# EAGLE board Timing_Control_V1p1 (EAGLE 9.6.2), part 1 of 2
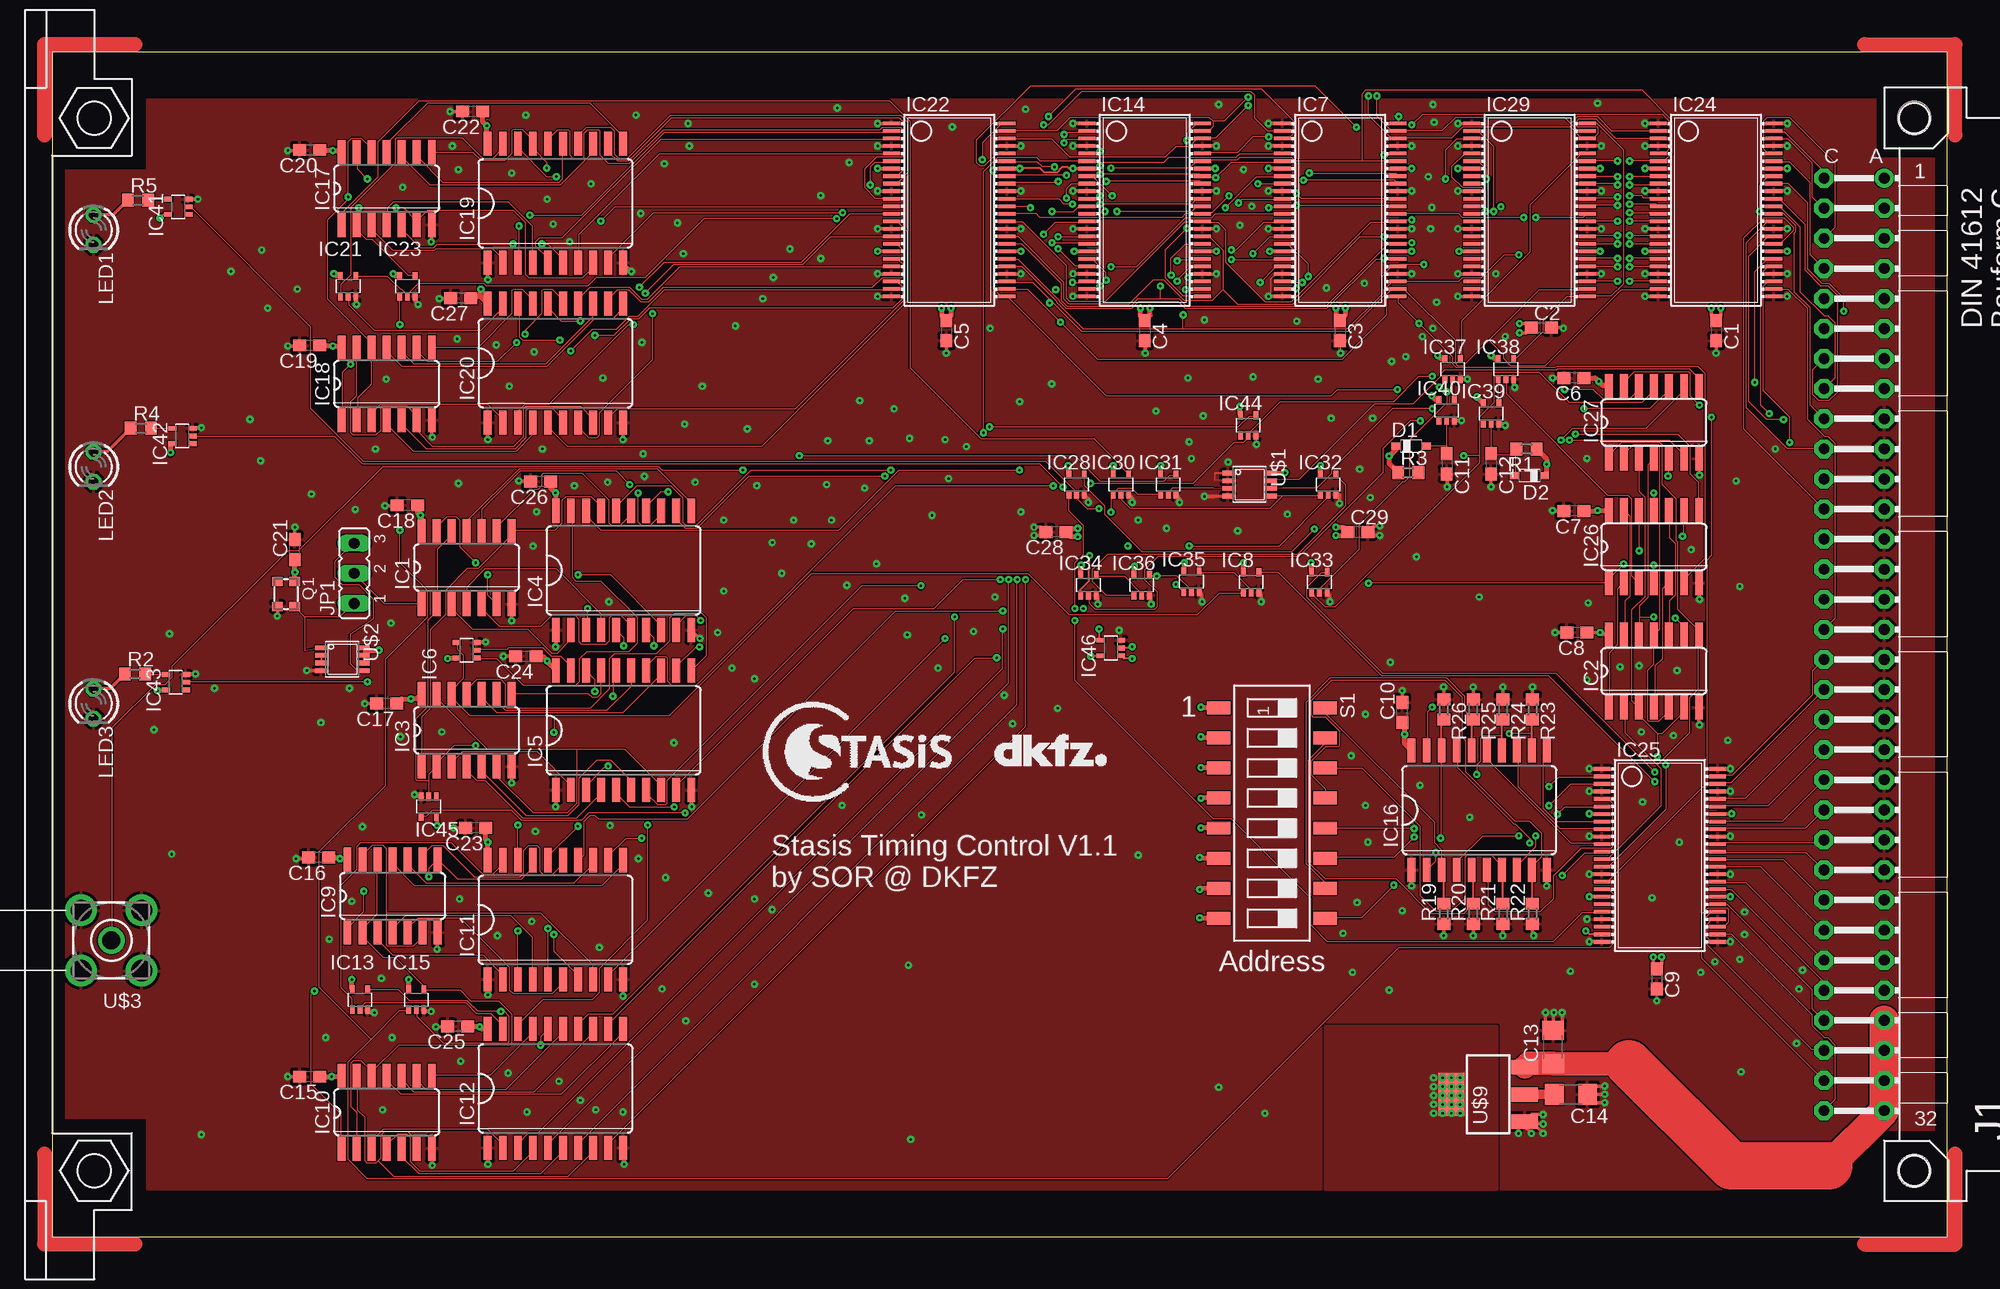
[diagram p5: board, top side]
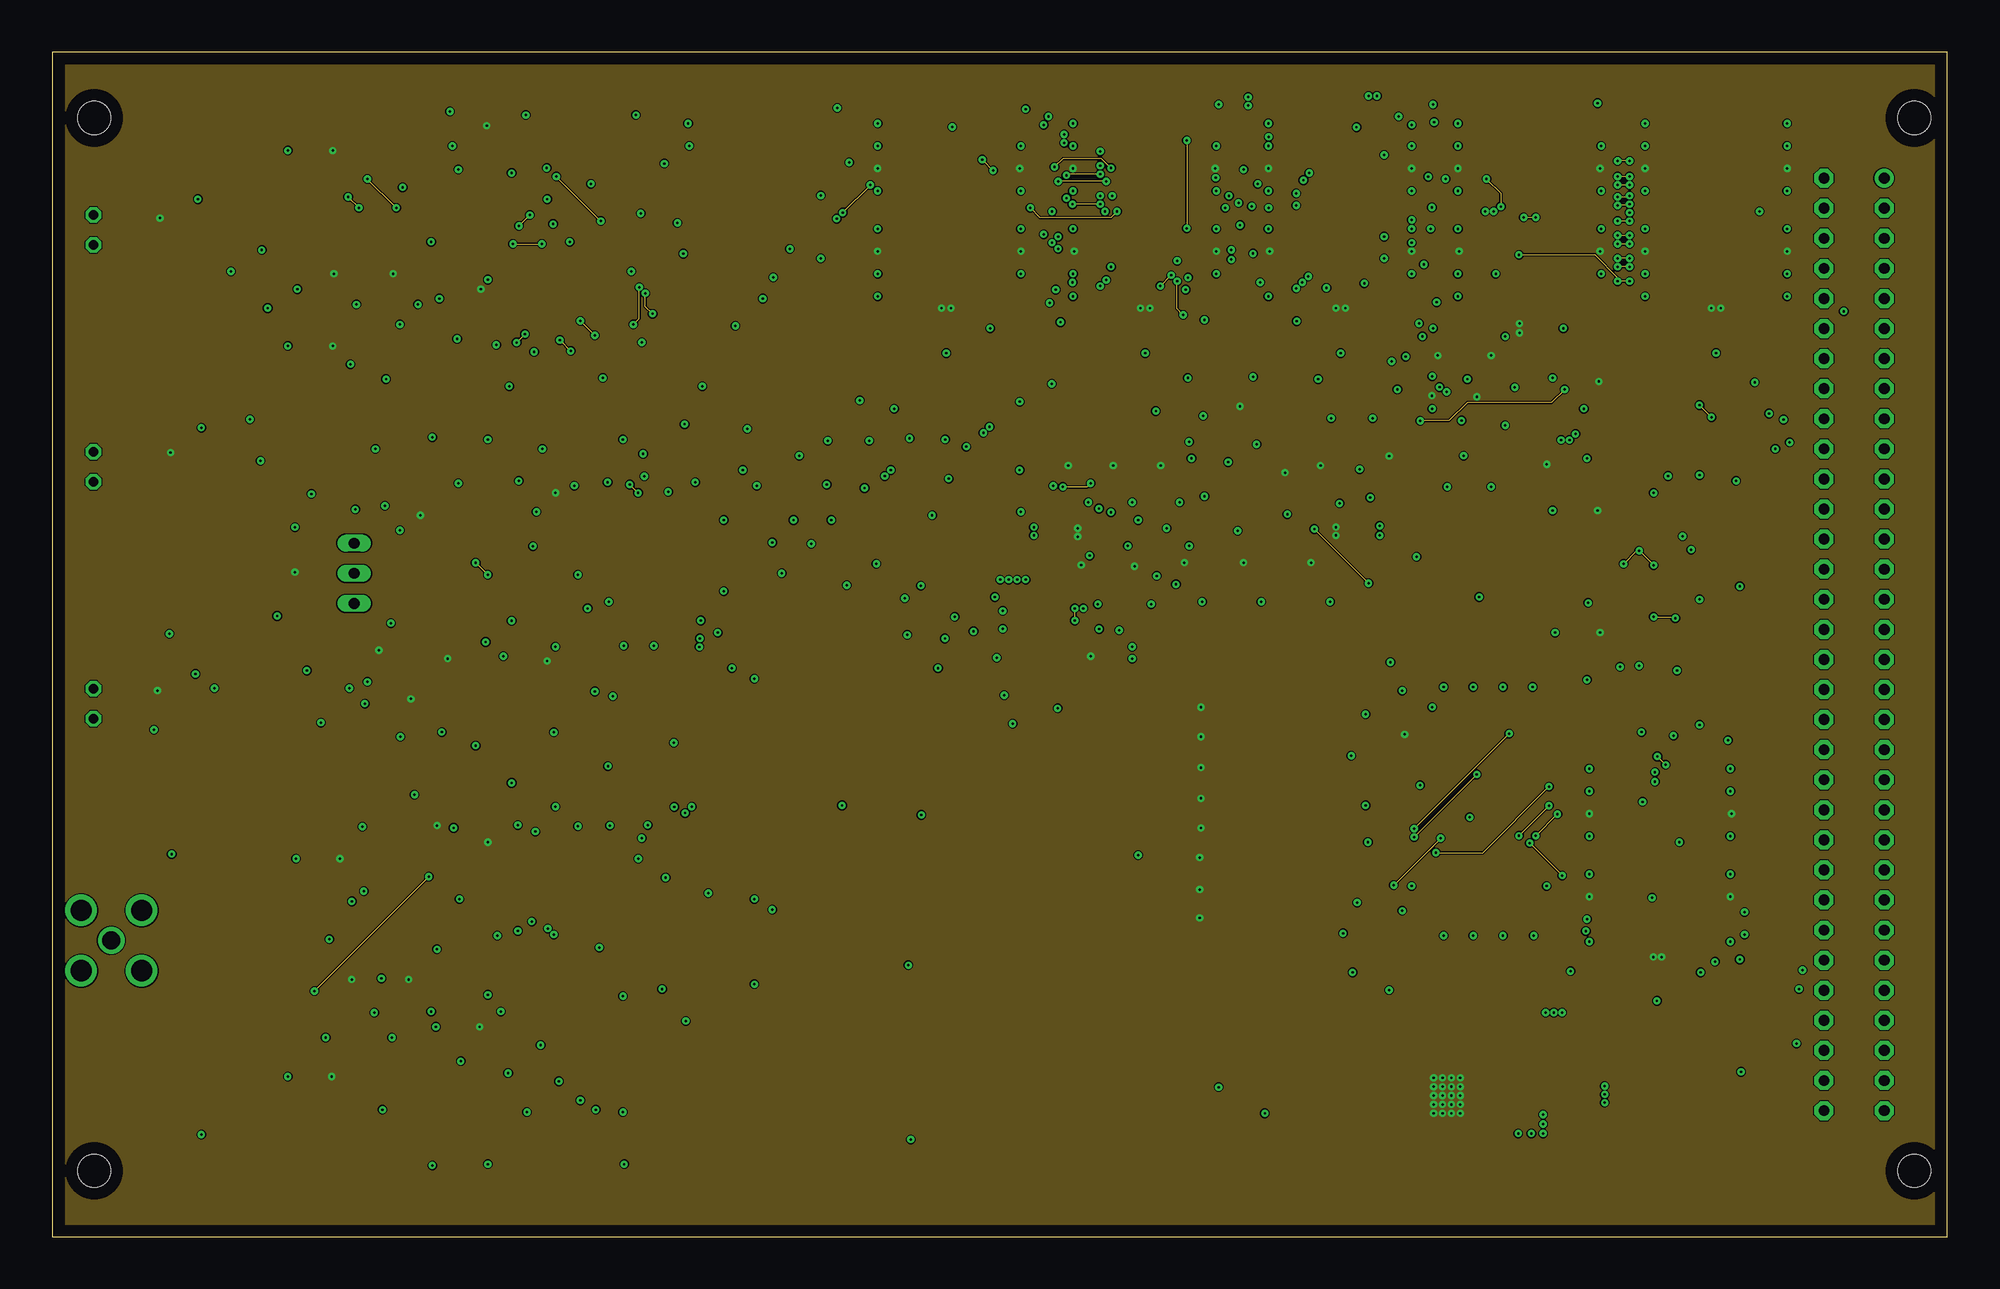
[diagram p6: board, inner layer VCC]
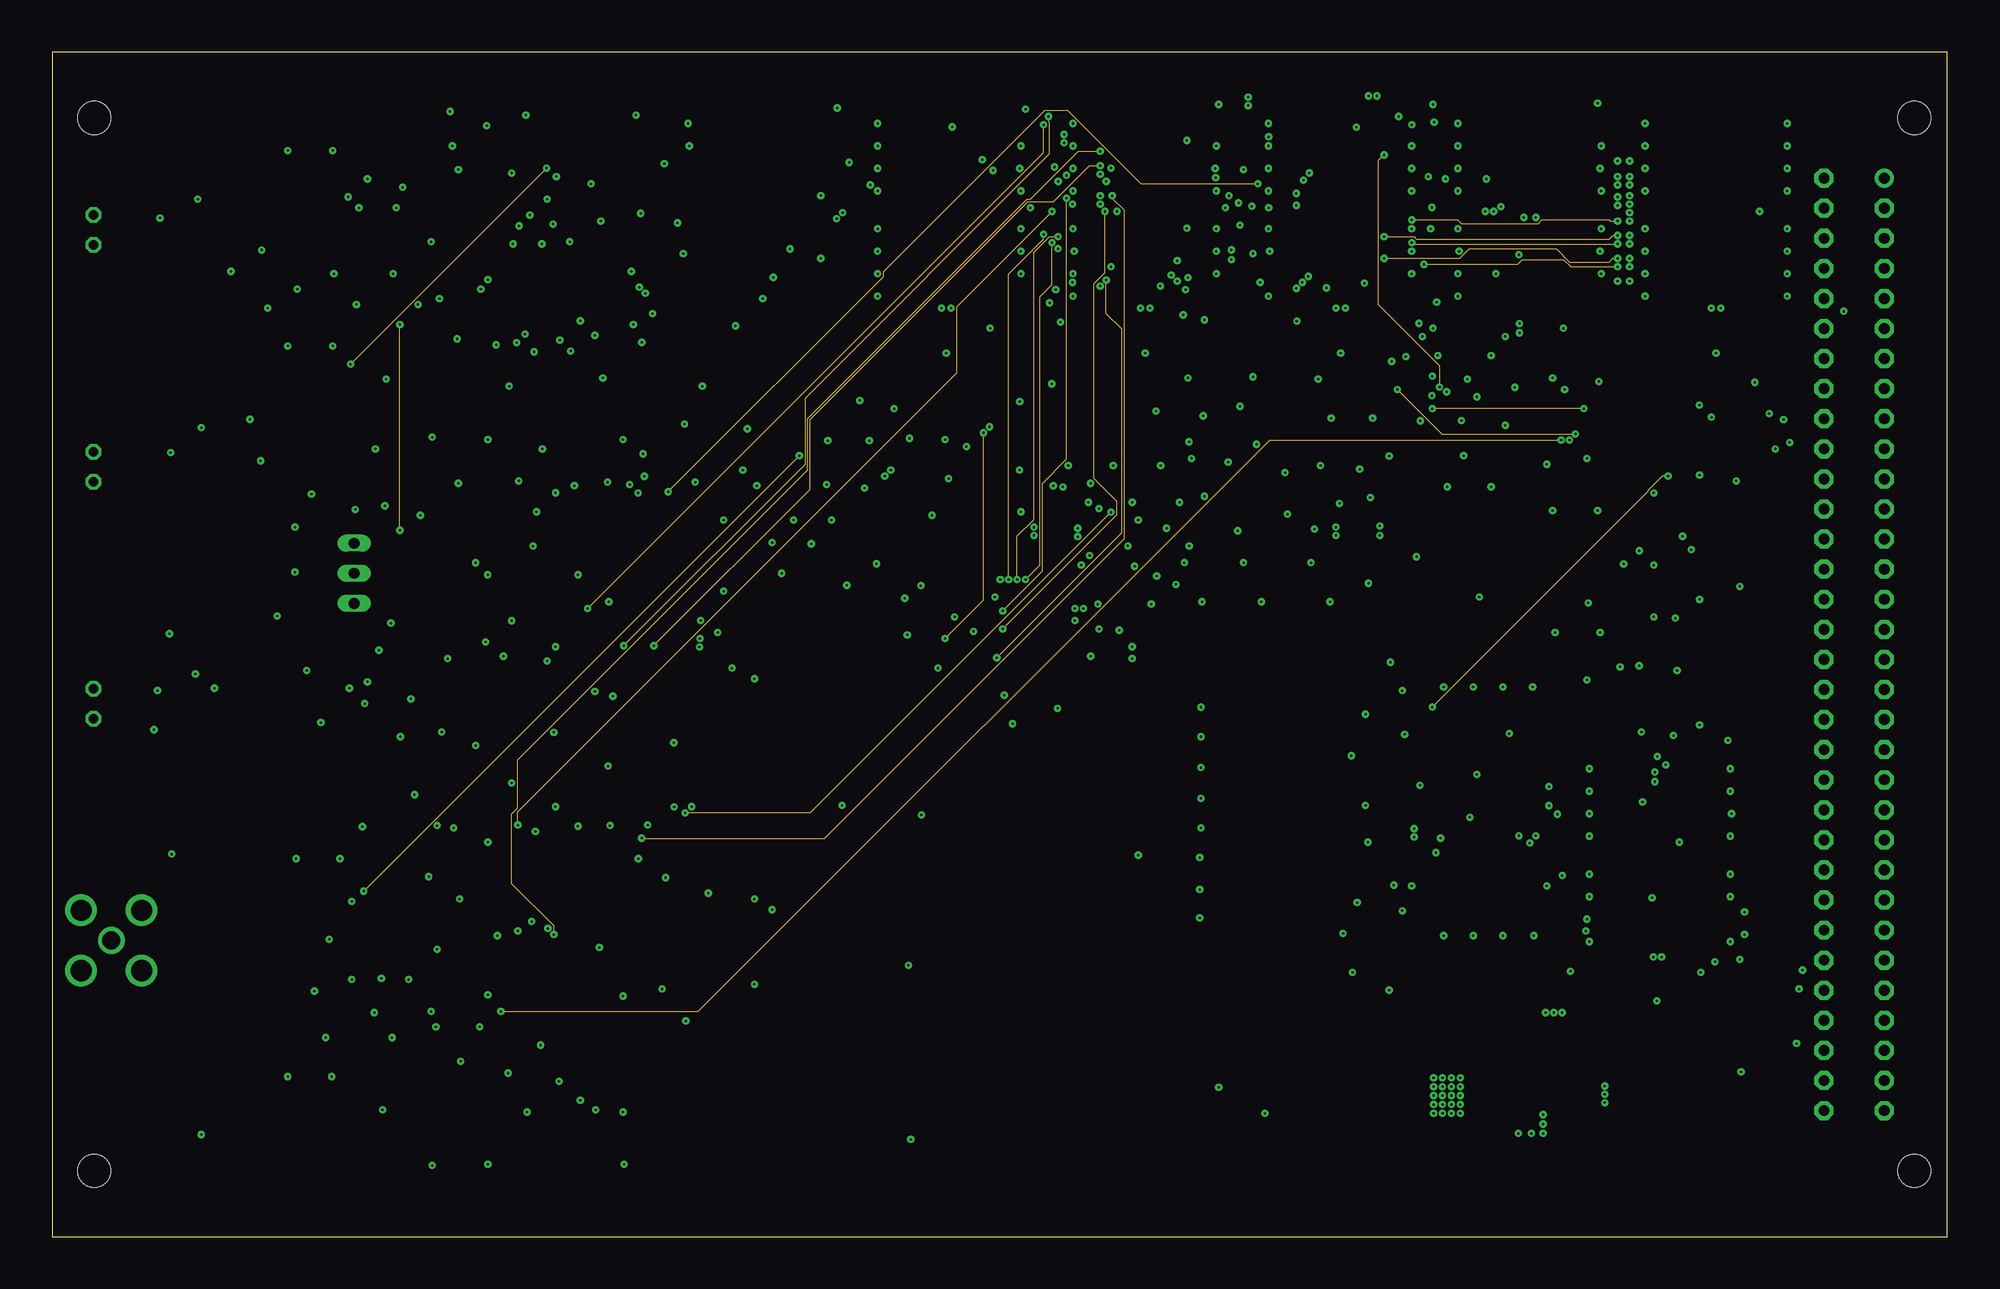
[diagram p7: board, inner layer Route3]
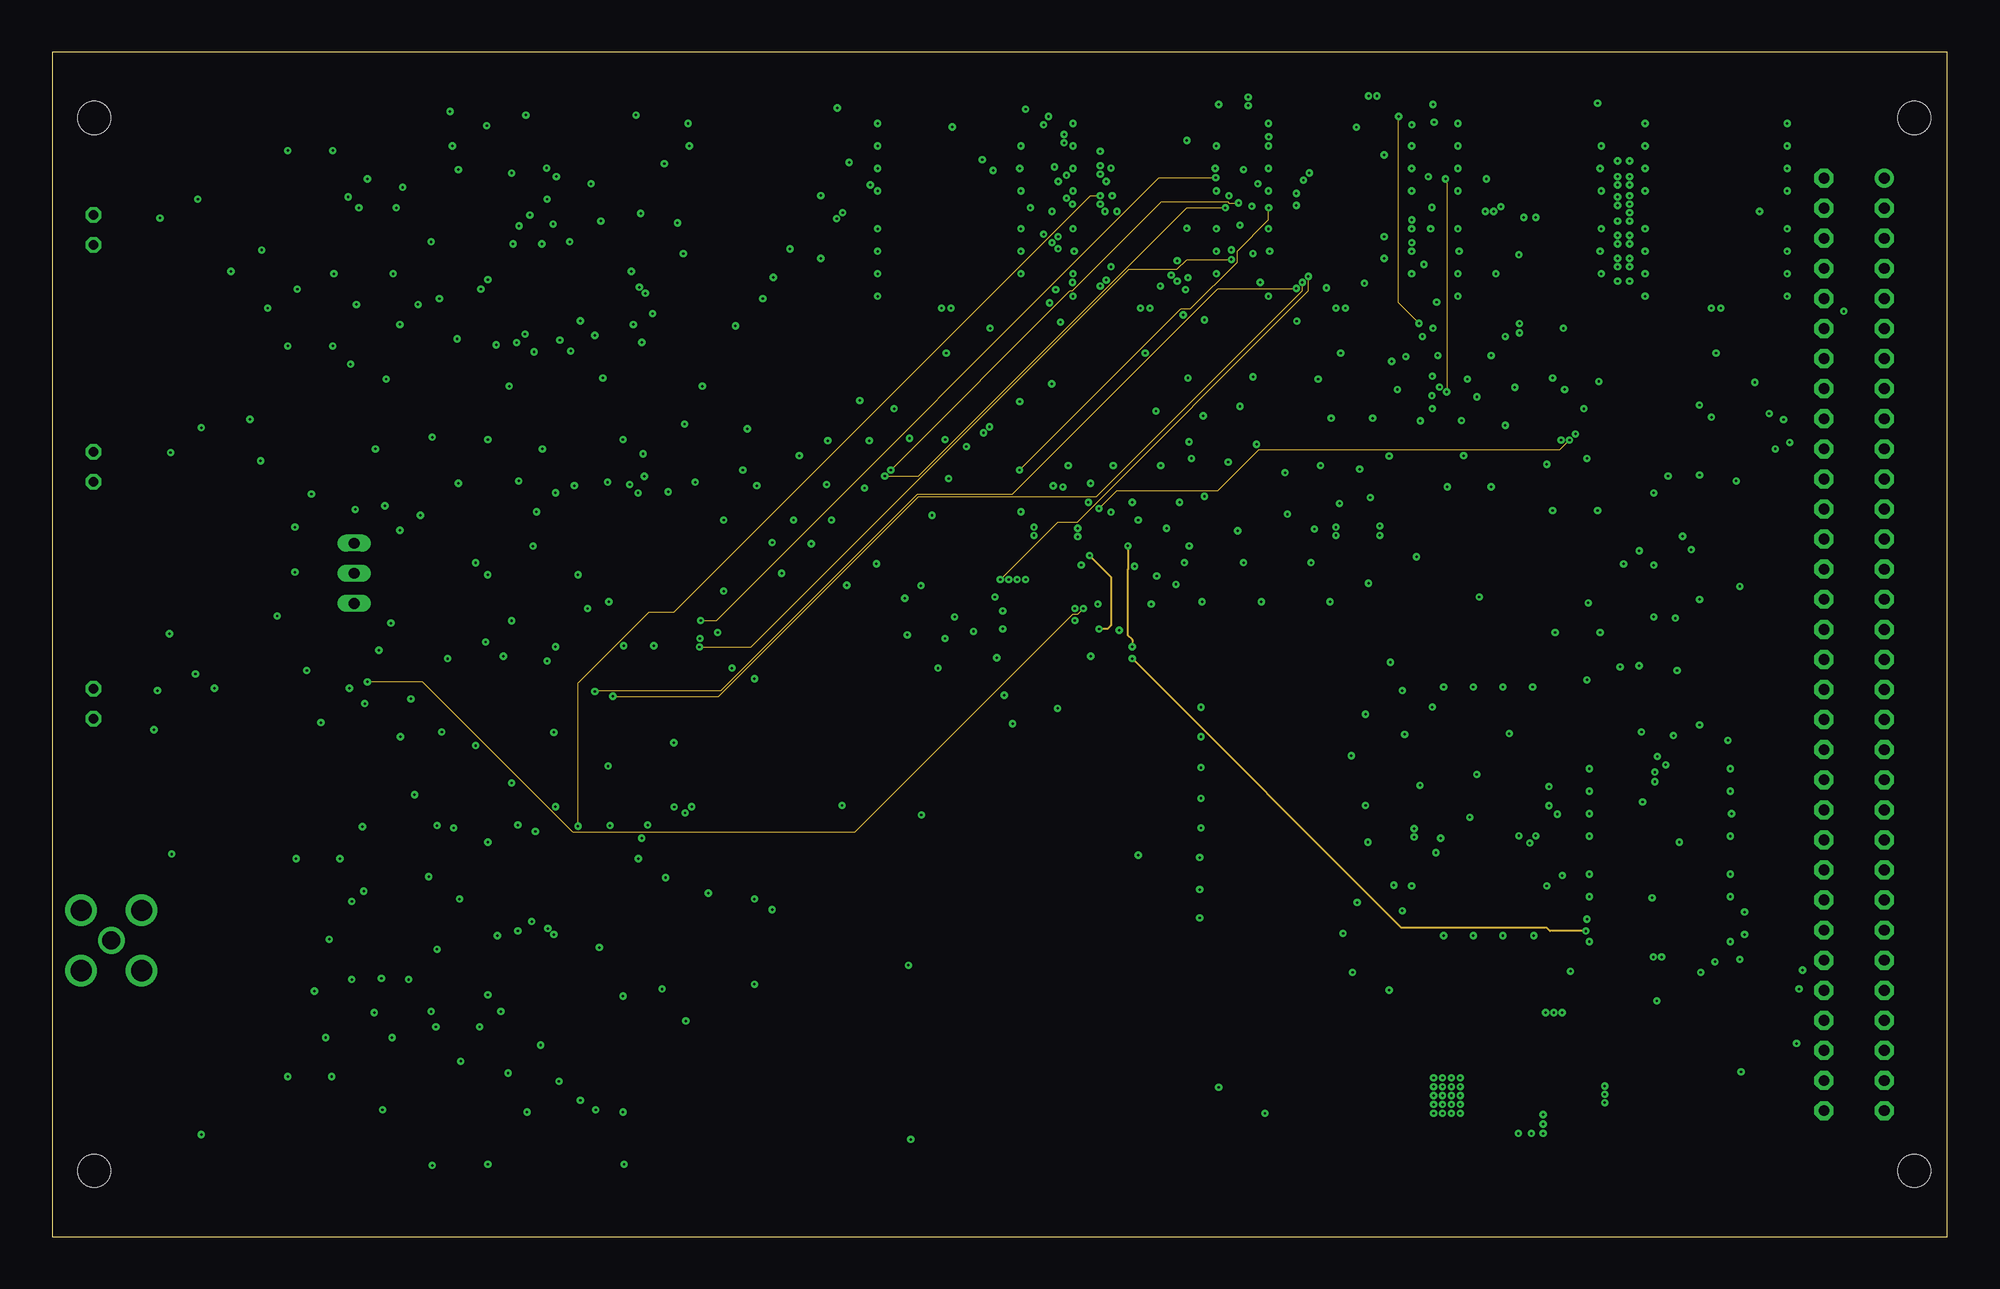
[diagram p8: board, inner layer Route14]
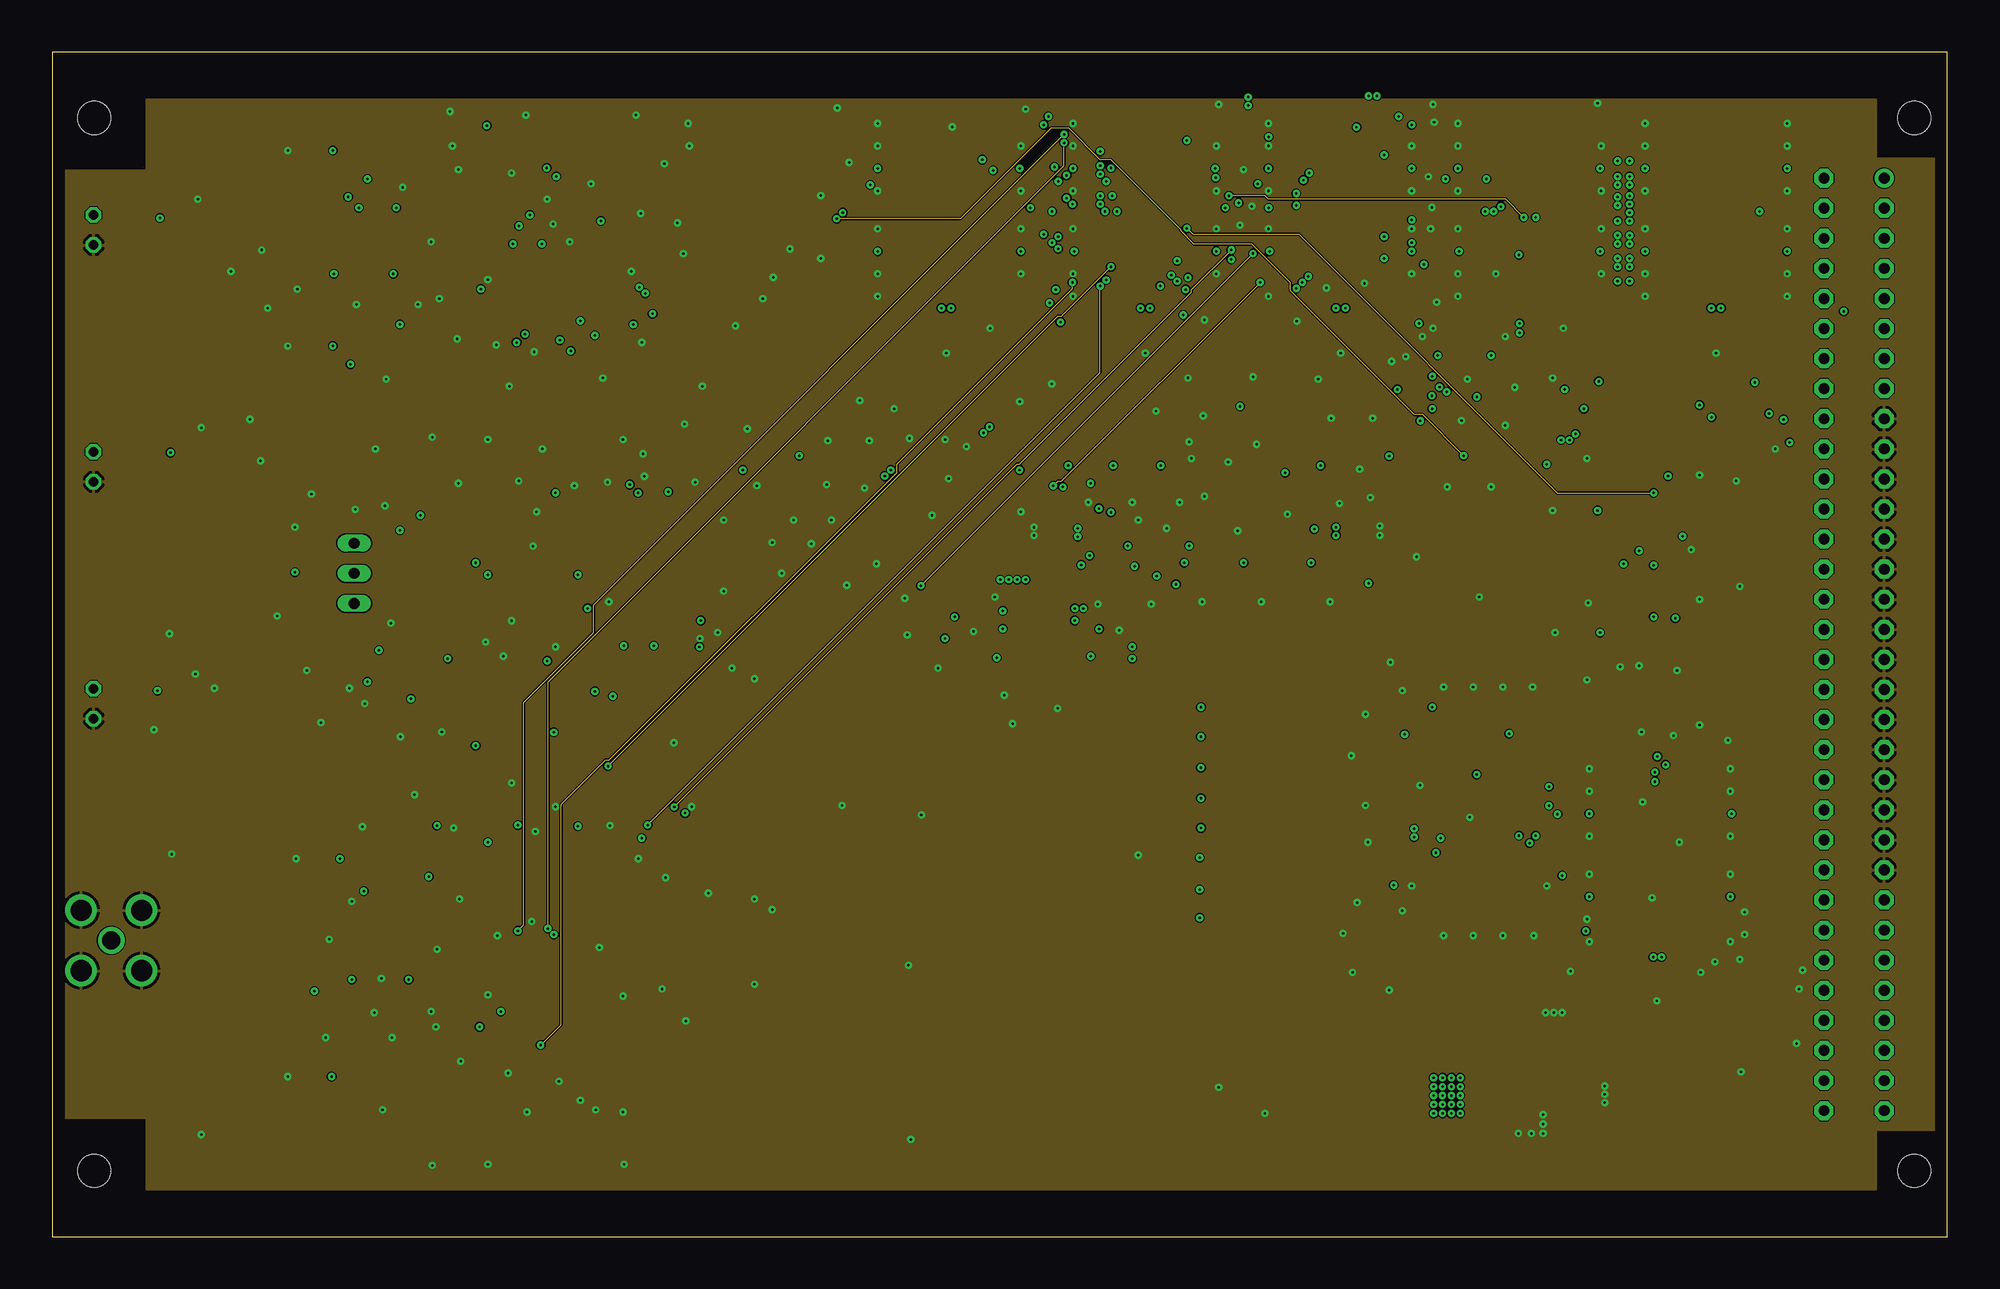
[diagram p9: board, inner layer Route15]
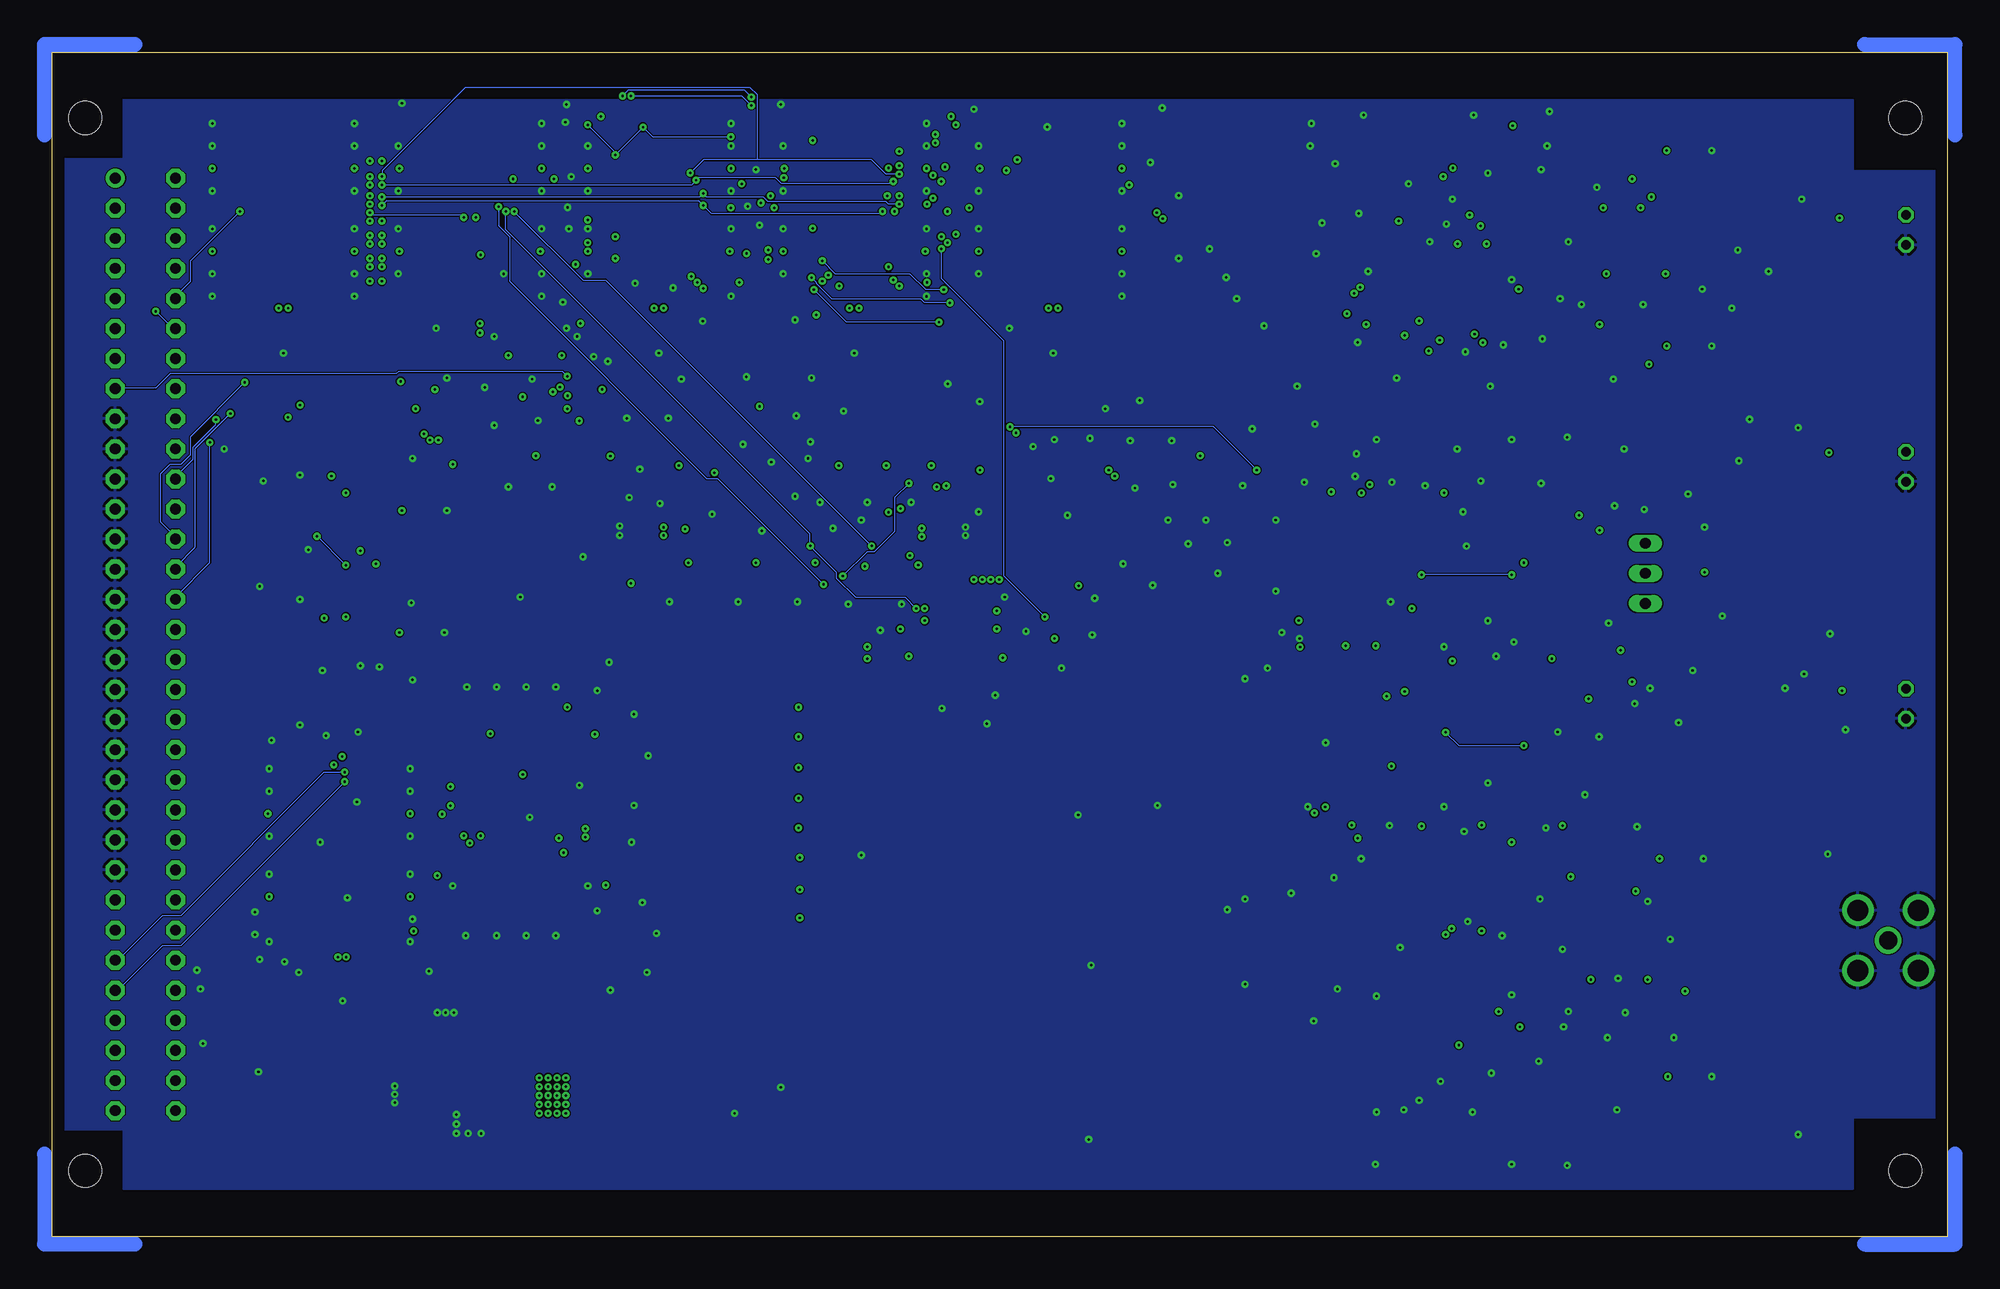
[diagram p10: board, bottom side, seen from below]

Size 160.02 x 100.03 mm. Coordinates in mm from the lower left corner, seen from the top.
Copper layers (1+2*3+14*15+16): Top 0.035mm / dielectric 0.23mm / VCC 0.035mm / dielectric 0.3mm / Route3 0.035mm / dielectric 0.34mm / Route14 0.035mm / dielectric 0.3mm / Route15 0.035mm / dielectric 0.23mm / Bottom 0.035mm
Design rules "default *": minimum track width 4mil, minimum drill 0.2mm, track to track 4mil, track to pad 4mil, pad to pad 4mil, via to via 4mil, smd to smd 4mil, copper to edge 40mil, drill to drill 6mil, minimum pad ring 10mil, minimum via ring 8mil, stop-mask expansion 4mil, vias tented up to drill 20mil, thermal gap 10mil

## Footprints (pad centres in the part's own frame; a part is rotated, then mirrored left to right if it is on the bottom)
C0603 = smd 1.1 x 1: 1 -0.85,0; 2 0.85,0
C1206 = smd 1.6 x 1.8: 1 -1.4,0; 2 1.4,0
SOD323_ST = smd 0.8 x 0.6: A 1.25,0; C -1.25,0
SO14 = smd 0.66 x 2.032: 1 -3.81,-3.073; 2 -2.54,-3.073; 3 -1.27,-3.073; 4 0,-3.073; 5 1.27,-3.073; 6 2.54,-3.073; 7 3.81,-3.073; 8 3.81,3.073; 9 2.54,3.073; 10 1.27,3.073; 11 0,3.073; 12 -1.27,3.073; 13 -2.54,3.073; 14 -3.81,3.073
SO20W = smd 0.66 x 2.032: 1 -5.715,-5.029; 2 -4.445,-5.029; 3 -3.175,-5.029; 4 -1.905,-5.029; 5 -0.635,-5.029; 6 0.635,-5.029; 7 1.905,-5.029; 8 3.175,-5.029; 9 4.445,-5.029; 10 5.715,-5.029; 11 5.715,5.029; 12 4.445,5.029; 13 3.175,5.029; 14 1.905,5.029; 15 0.635,5.029; 16 -0.635,5.029; 17 -1.905,5.029; 18 -3.175,5.029; 19 -4.445,5.029; 20 -5.715,5.029
SC70-5 = smd 0.4 x 0.7: 1 -0.65,-0.85; 2 0,-0.85; 3 0.65,-0.85; 4 0.65,0.85; 5 -0.65,0.85
SSOP48DL = smd 0.305 x 1.422: 1 -6.985,-4.877; 2 -6.35,-4.877; 3 -5.715,-4.877; 4 -5.08,-4.877; 5 -4.445,-4.877; 6 -3.81,-4.877; 7 -3.175,-4.877; 8 -2.54,-4.877; 9 -1.905,-4.877; 10 -1.27,-4.877; 11 -0.635,-4.877; 12 0,-4.877; 13 0.635,-4.877; 14 1.27,-4.877; 15 1.905,-4.877; 16 2.54,-4.877; 17 3.175,-4.877; 18 3.81,-4.877; 19 4.445,-4.877; 20 5.08,-4.877; 21 5.715,-4.877; 22 6.35,-4.877; 23 6.985,-4.877; 24 7.62,-4.877; 25 7.62,4.877; 26 6.985,4.877; 27 6.35,4.877; 28 5.715,4.877; 29 5.08,4.877; 30 4.445,4.877; 31 3.81,4.877; 32 3.175,4.877; 33 2.54,4.877; 34 1.905,4.877; 35 1.27,4.877; 36 0.635,4.877; 37 0,4.877; 38 -0.635,4.877; 39 -1.27,4.877; 40 -1.905,4.877; 41 -2.54,4.877; 42 -3.175,4.877; 43 -3.81,4.877; 44 -4.445,4.877; 45 -5.08,4.877; 46 -5.715,4.877; 47 -6.35,4.877; 48 -6.985,4.877
VG64P = drill 0.914 pad 1.6: A1 154.94,39.37 | drill 0.914 pad 1.6 octagon: A2 154.94,36.83; A3 154.94,34.29; A4 154.94,31.75; A5 154.94,29.21; A6 154.94,26.67; A7 154.94,24.13; A8 154.94,21.59; A9 154.94,19.05; A10 154.94,16.51; A11 154.94,13.97; A12 154.94,11.43; A13 154.94,8.89; A14 154.94,6.35; A15 154.94,3.81; A16 154.94,1.27; A17 154.94,-1.27; A18 154.94,-3.81; A19 154.94,-6.35; A20 154.94,-8.89; A21 154.94,-11.43; A22 154.94,-13.97; A23 154.94,-16.51; A24 154.94,-19.05; A25 154.94,-21.59; A26 154.94,-24.13; A27 154.94,-26.67; A28 154.94,-29.21; A29 154.94,-31.75; A30 154.94,-34.29; A31 154.94,-36.83; A32 154.94,-39.37; C1 149.86,39.37; C2 149.86,36.83; C3 149.86,34.29; C4 149.86,31.75; C5 149.86,29.21; C6 149.86,26.67; C7 149.86,24.13; C8 149.86,21.59; C9 149.86,19.05; C10 149.86,16.51; C11 149.86,13.97; C12 149.86,11.43; C13 149.86,8.89; C14 149.86,6.35; C15 149.86,3.81; C16 149.86,1.27; C17 149.86,-1.27; C18 149.86,-3.81; C19 149.86,-6.35; C20 149.86,-8.89; C21 149.86,-11.43; C22 149.86,-13.97; C23 149.86,-16.51; C24 149.86,-19.05; C25 149.86,-21.59; C26 149.86,-24.13; C27 149.86,-26.67; C28 149.86,-29.21; C29 149.86,-31.75; C30 149.86,-34.29; C31 149.86,-36.83; C32 149.86,-39.37 | hole 2.794: 3.81,44.45; 3.81,-44.45; 157.48,44.45; 157.48,-44.45
JP2 = drill 0.914 long: 1 -2.54,0; 2 0,0; 3 2.54,0
LED3MM = drill 0.813 octagon: A -1.27,0; K 1.27,0
2.5X2.0_KXO-86-TCXO = smd 0.75 x 0.9: 1 -1.05,-0.725; 2 1.05,-0.725; 3 1.05,0.725; 4 -1.05,0.725
R0603 = smd 1 x 1.1: 1 -0.85,0; 2 0.85,0
SMS-008 = smd 1.092 x 2.007: 1 -8.89,-4.496; 2 -6.35,-4.496; 3 -3.81,-4.496; 4 -1.27,-4.496; 5 1.27,-4.496; 6 3.81,-4.496; 7 6.35,-4.496; 8 8.89,-4.496; 9 8.89,4.496; 10 6.35,4.496; 11 3.81,4.496; 12 1.27,4.496; 13 -1.27,4.496; 14 -3.81,4.496; 15 -6.35,4.496; 16 -8.89,4.496
SSOP08 = smd 0.4 x 1: 1 -0.975,-1.8; 2 -0.325,-1.8; 3 0.325,-1.8; 4 0.975,-1.8; 5 0.975,1.8; 6 0.325,1.8; 7 -0.325,1.8; 8 -0.975,1.8
BU-SMA-H = drill 1.5: 1 0,0 | drill 1.778: 2 -2.55,2.55; 3 2.55,2.55; 4 2.55,-2.55; 5 -2.55,-2.55
SOT223 = smd 1.219 x 2.235: 1 -2.311,-3.099; 2 0,-3.099; 3 2.311,-3.099 | smd 3.6 x 2.2: 4 0,3.099

## Placement (x,y rotation side)
C1  10nF  [C0603]  140.5,76.51 270 top
C2  10nF  [C0603]  125.75,76.76 0 top
C3  10nF  [C0603]  108.75,76.51 270 top
C4  10nF  [C0603]  92.25,76.51 270 top
C5  10nF  [C0603]  75.5,76.51 270 top
C6  10nF  [C0603]  128.5,72.51 180 top
C7  10nF  [C0603]  128.5,61.26 180 top
C8  10nF  [C0603]  128.75,51.01 180 top
C9  10nF  [C0603]  135.5,21.76 270 top
C10  10nF  [C0603]  114,44.26 90 top
C11  10nF  [C0603]  117.75,65.26 270 top
C12  10nF  [C0603]  121.5,65.26 270 top
C13  10µF  [C1206]  126.75,16.01 90 top
C14  22µF  [C1206]  128.25,12.01 0 top
C15  10nF  [C0603]  21.75,13.51 180 top
C16  10nF  [C0603]  22.5,32.01 180 top
C17  10nF  [C0603]  28.25,45.01 180 top
C18  10nF  [C0603]  30,61.76 180 top
C19  10nF  [C0603]  21.75,75.26 180 top
C20  10nF  [C0603]  21.75,91.76 180 top
C21  10nF  [C0603]  20.5,58.01 90 top
C22  10nF  [C0603]  35.5,95.01 180 top
C23  10nF  [C0603]  35.75,34.51 180 top
C24  10nF  [C0603]  40,49.01 180 top
C25  10nF  [C0603]  34.25,17.76 180 top
C26  10nF  [C0603]  41.25,63.76 180 top
C27  10nF  [C0603]  34.5,79.26 180 top
C28  10nF  [C0603]  84.75,59.51 180 top
C29  10nF  [C0603]  110.25,59.51 0 top
D1  BAT60J  [SOD323_ST]  114.75,66.76 0 top
D2  BAT60J  [SOD323_ST]  124.75,64.26 180 top
IC1  SN74LV393ANSR  [SO14]  35,56.51 0 top
IC2  SN74LVC02AD  [SO14]  135.25,47.76 0 top
IC3  SN74LV393ANSR  [SO14]  35,42.76 0 top
IC4  74HC688DW  [SO20W]  48.25,56.26 0 top
IC5  74HC688DW  [SO20W]  48.25,42.76 0 top
IC6  74LVC1G02DCK  [SC70-5]  35,49.51 90 top
IC7  74AC16373  [SSOP48DL]  108.75,87.01 270 top
IC8  74LVC1G08DCK  [SC70-5]  101.25,55.26 0 top
IC9  SN74LV393ANSR  [SO14]  28.75,28.76 0 top
IC10  SN74LV393ANSR  [SO14]  28.25,10.51 0 top
IC11  74HC688DW  [SO20W]  42.5,26.76 0 top
IC12  74HC688DW  [SO20W]  42.5,12.51 0 top
IC13  74LVC1G02DCK  [SC70-5]  26,20.01 0 top
IC14  74AC16373  [SSOP48DL]  92.25,87.01 270 top
IC15  SN74LVC1G32DCKR  [SC70-5]  30.75,20.01 0 top
IC16  74HC688DW  [SO20W]  120.5,36.01 0 top
IC17  SN74LV393ANSR  [SO14]  28.25,88.51 0 top
IC18  SN74LV393ANSR  [SO14]  28.25,72.01 0 top
IC19  74HC688DW  [SO20W]  42.5,87.26 0 top
IC20  74HC688DW  [SO20W]  42.5,73.76 0 top
IC21  74LVC1G02DCK  [SC70-5]  25,80.26 0 top
IC22  74AC16373  [SSOP48DL]  75.75,87.01 270 top
IC23  SN74LVC1G32DCKR  [SC70-5]  30,80.26 0 top
IC24  SN74LVCH16244ADLR  [SSOP48DL]  140.5,87.01 270 top
IC25  SN74LVCH16244ADLR  [SSOP48DL]  135.75,32.51 270 top
IC26  74ALVC08  [SO14]  135.25,58.26 0 top
IC27  74AHC04D-Q100J  [SO14]  135.25,68.76 0 top
IC28  74LVC1G08DCK  [SC70-5]  86.5,63.51 0 top
IC29  74AC16373  [SSOP48DL]  124.75,87.01 270 top
IC30  74LVC1G08DCK  [SC70-5]  90.25,63.51 0 top
IC31  74LVC1G08DCK  [SC70-5]  94.25,63.51 0 top
IC32  SN74LVC1G32DCKR  [SC70-5]  107.75,63.51 0 top
IC33  74LVC1G08DCK  [SC70-5]  107,55.26 0 top
IC34  74LVC1G08DCK  [SC70-5]  87.5,55.01 0 top
IC35  74LVC1G08DCK  [SC70-5]  96.2,55.31 0 top
IC36  74LVC1G08DCK  [SC70-5]  92,55.01 0 top
IC37  74LVC1G08DCK  [SC70-5]  118.25,73.26 0 top
IC38  SN74LVC1G32DCKR  [SC70-5]  122.75,73.26 0 top
IC39  74LVC1G14DCK  [SC70-5]  121.5,69.51 0 top
IC40  74LVC1G17DCK  [SC70-5]  117.75,69.76 0 top
IC41  74LVC1G17DCK  [SC70-5]  10.65,86.96 90 top
IC42  74LVC1G17DCK  [SC70-5]  11,67.61 90 top
IC43  74LVC1G17DCK  [SC70-5]  10.45,46.81 90 top
IC44  74LVC1G17DCK  [SC70-5]  101,68.51 0 top
IC45  74LVC1G14DCK  [SC70-5]  31.8,36.31 180 top
IC46  74LVC1G08DCK  [SC70-5]  89.4,49.71 90 top
J1  BUS  [VG64P]  -0.25,50.01 0 top
JP1  1/2 Clock  [JP2]  25.5,56.01 90 top
LED1  10mA 2.2-2.4V  [LED3MM]  3.5,85.01 270 top
LED2  10mA 2.2-2.4V  [LED3MM]  3.5,65.01 270 top
LED3  10mA 2.2-2.4V  [LED3MM]  3.5,45.01 270 top
Q1  ECS-TXO-2520MV-100-AN-TR  [2.5X2.0_KXO-86-TCXO]  19.75,54.26 270 top
R1  1k  [R0603]  124.5,66.51 180 top
R2  120  [R0603]  7,47.51 0 top
R3  1k  [R0603]  114.5,64.51 0 top
R4  120  [R0603]  7.5,68.26 0 top
R5  120  [R0603]  7.25,87.51 0 top
R19  100k  [R0603]  117.5,27.26 90 top
R20  100k  [R0603]  120,27.26 90 top
R21  100k  [R0603]  122.5,27.26 90 top
R22  100k  [R0603]  125,27.26 90 top
R23  100k  [R0603]  125,44.51 270 top
R24  100k  [R0603]  122.5,44.51 270 top
R25  100k  [R0603]  120,44.51 270 top
R26  100k  [R0603]  117.5,44.51 270 top
S1  SWS008  [SMS-008]  103,35.76 270 top
U$1  74LVC2G74DP,125  [SSOP08]  101.1,63.51 270 top
U$2  74LVC2G74DP,125  [SSOP08]  24.5,48.76 270 top
U$3  SMA_CON-H  [BU-SMA-H]  5,25.01 180 top
U$4  [LOGO_STASIS]  69,40.71 0 top
U$5  [LOGO_DKFZ]  79.6,39.71 0 top
U$9  AZ1117IH-3.3TRG1  [SOT223]  121.25,12.01 90 top

## Tracks (layer width: path | path; a pad name or v marks a point on that pad's centre or on a via)
5V
  Top 2: 133.15,14.61 C13.1 126.73,14.62 124.64,14.62 U$9.3
  Top 2.54: J1.A29 J1.A30 J1.A31 J1.A32 150.01,5.96
  Top 4: 150.01,5.96 141.8,5.96 133.15,14.61
ADDR0  (via drill 0.2)
  Top 0.102: v126.39,38.01 127.2,38.82 130.86,38.82 IC25.2 | v116.84,32.42 116.84,31.71 116.12,31 IC16.2
  VCC 0.102: v126.39,38.01 120.8,32.42 v116.84,32.42
ADDR1  (via drill 0.2)
  Top 0.102: v126.39,36.39 128.22,38.21 130.86,38.21 IC25.3 | v123.85,33.85 120.8,33.85 118.66,31.71 118.66,31 IC16.4
  VCC 0.102: v123.85,33.85 v126.39,36.39
ADDR2
  Top 0.102: IC25.5 130.96,36.89 131.47,36.89 131.77,36.59 131.77,32.93 131.67,32.83 129.13,32.83 126.79,30.49 126.79,28.56 125.67,27.44 121.81,27.44 121.2,28.05 121.2,30.9 IC16.6
ADDR3  (via drill 0.2)
  Top 0.102: v127.1,35.67 127.71,36.28 130.86,36.28 IC25.6 | v125.27,33.85 125.27,32.93 123.74,31.41 123.74,31 IC16.8
  VCC 0.102: v125.27,33.85 v127.1,35.67
ADDR4
  Top 0.102: IC25.8 130.86,35.06 127,35.06 125.88,36.18 125.88,40.65 126.18,40.96 IC16.11
ADDR5
  Top 0.102: IC25.9 130.86,34.45 127.3,34.45 123.74,38.01 123.74,40.96 IC16.13
ADDR6
  Top 0.102: IC25.11 130.86,33.24 128.22,33.24 121.2,40.25 121.2,40.96 IC16.15
ADDR7  (via drill 0.2)
  Top 0.102: v127.5,30.49 129.43,32.42 130.86,32.42 IC25.12 | v124.76,33.24 124.76,33.64 123.54,34.86 123.44,34.86 118.66,39.64 118.66,40.96 IC16.17
  VCC 0.102: v124.76,33.24 v127.5,30.49
B1  (via drill 0.2)
  Top 0.102: v83.71,93.89 84.12,93.89 86.97,96.74 101.19,96.74 101.49,96.43 101.49,94.5 102.61,93.38 103.83,93.38 IC7.2 | v45.21,53.05 45.21,51.42 45.11,51.32 IC4.3
  Route3 0.102: v83.71,93.89 83.71,91.55 v45.21,53.05
B2  (via drill 0.2)
  Top 0.102: v84.12,94.6 86.46,96.94 102.1,96.94 104.75,94.3 104.75,93.08 104.44,92.77 103.93,92.77 IC7.3 | v48.26,49.9 48.26,50.61 47.65,51.22 IC4.5
  Route3 0.102: v84.12,94.6 84.12,94.2 84.22,94.09 84.22,91.45 63.6,70.83 63.6,65.24 v48.26,49.9
B3  (via drill 0.2)
  Top 0.102: v88.49,90.44 88.79,90.74 93.87,90.74 94.28,91.15 99.97,91.15 100.27,91.45 103.83,91.45 IC7.5 | v50.8,49.9 50.8,50.61 50.19,51.22 IC4.7
  Route3 0.102: v88.49,90.44 87.57,90.44 84.53,87.39 82.39,87.39 64,69 64,63.11 v50.8,49.9
B4  (via drill 0.2)
  Top 0.102: v98.24,89.42 99.56,90.74 103.83,90.74 IC7.6 | v54.76,52.03 54.35,52.44 53.54,52.44 52.73,51.63 52.73,51.32 IC4.9
  Route14 0.102: v98.24,89.42 93.47,89.42 56.08,52.03 v54.76,52.03
B5  (via drill 0.2)
  Top 0.102: v99.06,86.88 101.7,89.52 103.83,89.52 IC7.8 | v70.3,64.22 58.82,64.22 54.45,59.85 53.44,59.85 52.73,60.57 52.73,61.28 IC4.12
  Route14 0.102: v99.06,86.88 95.8,86.88 73.15,64.22 v70.3,64.22
B6  (via drill 0.2)
  Top 0.102: v101.8,88.91 103.83,88.91 IC7.9 | v52.02,62.9 51.41,62.9 50.19,61.68 50.19,61.38 IC4.14
  Route3 0.102: v101.8,88.91 91.94,88.91 85.75,95.11 83.82,95.11 70.2,81.5 70.2,81.09 v52.02,62.9
B7  (via drill 0.2)
  Top 0.102: v100.17,87.29 100.48,87.59 103.83,87.59 IC7.11 | v70.81,64.73 59.03,64.73 54.35,60.06 53.54,60.06 53.23,60.36 53.23,62.39 52.22,63.41 49.37,63.41 47.65,61.68 47.65,61.38 IC4.16
  Route14 0.102: v100.17,87.29 99.36,87.29 99.26,87.39 93.67,87.39 86.15,79.87 85.95,79.87 v70.81,64.73
B8  (via drill 0.2)
  Top 0.102: v102.71,86.88 102.81,86.98 103.83,86.98 IC7.12 | v81.68,64.73 71.52,64.73 66.44,59.65 46.33,59.65 45.11,60.87 45.11,61.28 IC4.18
  Route14 0.102: v102.71,86.88 102.71,85.86 100.07,83.22 100.07,82.31 96.11,78.35 95.3,78.35 v81.68,64.73
B9  (via drill 0.2)
  Top 0.102: v89.4,81.9 91.54,81.9 95.7,86.07 97.94,86.07 98.24,86.37 103.83,86.37 IC7.13 | v46.94,39.74 46.73,39.74 45.11,38.11 45.11,37.81 IC5.3
  Route15 0.102: v89.4,81.9 85.24,77.74 84.93,77.74 v46.94,39.74
B10  (via drill 0.2)
  Top 0.102: v99.56,83.32 99.97,83.32 102.31,85.66 103.83,85.66 IC7.14 | v52.52,36.28 48.76,36.28 47.65,37.4 47.65,37.71 IC5.5
  Route15 0.102: v99.56,83.32 96.21,79.97 96.21,79.77 81.68,65.24 81.48,65.24 v52.52,36.28
B11  (via drill 0.2)
  Top 0.102: v101.39,83.02 102.81,84.44 103.83,84.44 IC7.16 | v73.35,54.98 68.37,54.98 51.91,38.52 51.91,36.59 51.81,36.49 51.1,36.49 50.19,37.4 50.19,37.71 IC5.7
  Route15 0.102: v73.35,54.98 v101.39,83.02
B12  (via drill 0.2)
  Top 0.102: v106.07,81.09 106.07,82.11 104.34,83.83 103.93,83.83 IC7.17 | v80.06,55.49 76.91,55.49 74.47,53.05 67.66,53.05 52.73,38.11 52.73,37.81 IC5.9
  Route14 0.102: v106.07,81.09 106.07,79.87 86.56,60.36 84.93,60.36 v80.06,55.49
B13  (via drill 0.2)
  Top 0.102: v99.56,82.51 103.83,82.51 IC7.19 | v54.66,49.8 54.35,49.8 52.73,48.17 52.73,47.87 IC5.12
  Route14 0.102: v99.56,82.51 95.8,82.51 94.99,81.7 90.93,81.7 59.03,49.8 v54.66,49.8
B14  (via drill 0.2)
  Top 0.102: v102,80.58 103.32,81.9 103.83,81.9 IC7.20 | v84.53,63.41 71.22,63.41 54.35,46.55 52.32,46.55 51.91,46.95 51.91,48.88 51.81,48.98 51,48.98 50.19,48.17 50.19,47.87 IC5.14
  Route15 0.102: v102,80.58 85.24,63.82 84.93,63.82 v84.53,63.41
B15  (via drill 0.2)
  Top 0.102: v105.56,80.58 103.93,80.58 IC7.22 | v47.34,45.63 47.34,47.56 47.55,47.76 IC5.16
  Route14 0.102: v105.56,80.58 105.56,79.87 88.18,62.5 73.15,62.5 56.28,45.63 v47.34,45.63
B16  (via drill 0.2)
  Top 0.102: v105.05,80.07 103.93,80.07 IC7.23 | v45.82,46.04 45.82,47.05 45.11,47.76 IC5.18
  Route14 0.102: v105.05,80.07 98.45,80.07 81.07,62.7 73.05,62.7 56.49,46.14 45.92,46.14 v45.82,46.04
C1  (via drill 0.2)
  Top 0.102: v40.33,86.27 44.7,86.27 51.71,93.28 70.81,93.28 IC22.2 | v39.42,85.36 39.42,82.31 IC19.3
  VCC 0.102: v39.42,85.36 v40.33,86.27
C2
  Top 0.102: IC22.3 70.81,92.67 51.41,92.67 43.07,84.34 41.14,84.34 40.84,84.04 40.84,83.63 41.86,82.61 41.86,82.31 IC19.5
C3
  Top 0.102: IC22.5 70.81,91.45 51.3,91.45 44.5,84.65 44.5,82.31 IC19.7
C4  (via drill 0.2)
  Top 0.102: v69.08,88.81 69.08,90.33 69.49,90.74 70.81,90.74 IC22.6 | v66.75,86.47 50.8,86.47 47.04,82.71 47.04,82.31 IC19.9
  VCC 0.102: v66.75,86.47 v69.08,88.81
C5
  Top 0.102: IC22.8 70.91,89.62 71.42,89.62 72.03,90.23 72.03,93.99 71.52,94.5 52.32,94.5 48.66,90.84 47.75,90.84 47.04,91.55 47.04,92.27 IC19.12
C6
  Top 0.102: IC22.9 70.91,89.01 71.42,89.01 72.23,89.83 72.23,94.09 71.62,94.7 52.22,94.7 48.56,91.05 47.85,91.05 47.44,91.45 47.44,93.38 47.14,93.69 45.11,93.69 44.5,93.08 44.5,92.37 IC19.14
C7
  Top 0.102: IC22.11 70.81,87.69 69.49,87.69 68.58,88.61 68.58,90.13 69.59,91.15 71.73,91.15 71.83,91.25 71.83,93.48 71.62,93.69 70.1,93.69 69.9,93.48 51.61,93.48 48.76,90.64 46.94,90.64 46.22,91.35 46.22,93.38 46.12,93.48 45.21,93.48 44.9,93.18 44.9,91.15 44.8,91.05 43.99,91.05 43.68,91.35 43.68,93.38 43.58,93.48 42.67,93.48 41.96,92.77 41.96,92.37 IC19.16
C8  (via drill 0.2)
  Top 0.102: v46.33,85.76 47.55,86.98 70.81,86.98 IC22.12 | v42.57,89.52 41.75,89.52 39.42,91.86 39.42,92.27 IC19.18
  VCC 0.102: v42.57,89.52 v46.33,85.76
C9  (via drill 0.2)
  Top 0.102: v49.58,80.17 51.71,82.31 63.29,82.31 67.36,86.37 70.81,86.37 IC22.13 | v49.07,77.03 48.66,77.03 41.96,70.32 39.93,70.32 39.42,69.81 39.42,68.8 IC20.3
  VCC 0.102: v49.58,80.17 49.58,77.53 v49.07,77.03
C10
  Top 0.102: IC22.14 70.91,85.66 71.42,85.66 72.23,84.85 72.23,79.06 59.94,66.76 43.48,66.76 41.96,68.29 41.96,68.69 IC20.5
C11  (via drill 0.2)
  Top 0.102: v50.09,79.67 52.52,82.11 63.39,82.11 65.73,84.44 70.81,84.44 IC22.16 | v50.69,77.94 50.69,74.08 46.22,69.61 46.22,67.68 46.02,67.47 45.31,67.47 44.5,68.29 44.5,68.69 IC20.7
  VCC 0.102: v50.09,79.67 50.09,78.55 v50.69,77.94
C12
  Top 0.102: IC22.17 70.91,83.83 71.32,83.83 72.03,83.12 72.03,79.16 62.79,69.91 47.75,69.91 47.04,69.2 47.04,68.8 IC20.9
C13
  Top 0.102: IC22.19 70.91,82.51 71.42,82.51 71.83,82.11 71.83,81.09 71.73,80.99 70.1,80.99 69.29,80.17 51.61,80.17 50.39,78.96 49.68,78.96 48.66,79.97 47.75,79.97 47.04,79.26 47.04,78.85 IC20.12
C14
  Top 0.102: IC22.20 70.81,81.9 53.03,81.9 50.29,79.16 49.78,79.16 48.76,80.17 45.41,80.17 44.5,79.26 44.5,78.85 IC20.14
C15  (via drill 0.2)
  Top 0.102: v45.82,76.11 47.44,76.11 48.87,77.53 49.58,77.53 50.49,78.45 71.01,78.45 71.83,79.26 71.83,80.17 71.42,80.58 70.91,80.58 IC22.22 | v44.6,77.33 42.97,77.33 41.96,78.35 41.96,78.75 IC20.16
  VCC 0.102: v44.6,77.33 v45.82,76.11
C16  (via drill 0.2)
  Top 0.102: v43.79,74.79 45.61,76.62 47.65,76.62 48.76,77.74 49.48,77.74 51.71,79.97 70.81,79.97 IC22.23 | v42.87,75.7 39.72,75.7 39.42,76.01 39.42,78.75 IC20.18
  VCC 0.102: v42.87,75.7 v43.79,74.79
CHIP0
  Top 0.102: 135.53,39.84 132.79,42.58 132.79,44.61 IC2.2 | 135.53,39.84 135.84,39.53 135.84,36.39 131.37,31.91 130.96,31.91 IC25.13 | 135.53,39.84 138.27,42.58 138.27,45.53 138.99,46.24 138.99,50.81 IC2.8 138.99,50.91 138.99,51.22 137.26,52.95 137.26,58.64 137.16,58.74 137.16,62.29 135.94,63.51 135.94,66.87 135.73,67.07 132.48,67.07 131.47,66.05 131.47,65.75 IC27.1
CHIP1  (via drill 0.2)
  Top 0.102: v136.24,39.84 136.24,36.08 131.47,31.31 130.96,31.31 IC25.14 | 135.53,42.48 v135.53,40.55 | 135.53,42.48 134.01,44.01 134.01,44.61 IC2.3 133.91,44.72 133.4,45.22 133.4,52.95 134.51,54.06 134.51,62.39 134.01,62.9 134.01,65.65 IC27.3 | 135.53,42.48 135.94,42.48 137.77,44.31 137.77,44.61 IC2.6
  VCC 0.102: v135.53,40.55 v136.24,39.84
CLK
  Top 0.102: IC1.1 31.09,53.45 28.04,53.45 25.5,55.99 JP1.2
CLK_C
  Top 0.102: IC30.4 90.83,64.43 90.11,65.14 90.11,65.24 87.98,67.37 78.43,67.37 72.44,73.37 72.44,94.2 70.71,95.92 30.98,95.92 27.53,92.47 27.53,89.52 24.48,86.47 24.48,85.46 IC17.1
CLK_D  (via drill 0.2)
  Top 0.102: v63.09,65.95 86.36,65.95 88.49,63.82 93.87,63.82 94.38,64.33 94.89,64.33 IC31.4 | v26.31,29.17 26.31,27.44 24.99,26.12 24.99,25.72 IC9.1
  Route3 0.102: v26.31,29.17 v63.09,65.95
CLR1
  Top 0.102: 26.92,14.03 26.11,14.85 25.4,14.85 25.19,14.64 25.19,10.99 25.7,10.48 25.7,7.53 IC10.2 | 26.92,14.03 26.92,13.63 IC10.12 26.92,14.03 | IC9.12 27.43,31.81 27.43,27.24 26.21,26.02 26.21,25.72 IC9.2 26.21,25.62 26.21,25.31 27.94,23.58 28.95,23.58 31.39,21.15 31.39,20.94 IC15.4 31.49,20.84 34.44,20.84 35.35,19.93 37.69,19.93 38.81,18.81 38.81,16.37 38.6,16.17 29.26,16.17 27.12,14.03 26.92,14.03
CLR2  (via drill 0.2)
  Top 0.102: IC23.4 30.58,81.19 30.07,81.19 27.02,84.24 26.51,84.24 25.8,84.95 25.8,85.36 IC17.2 25.8,85.46 25.8,86.78 v25.9,86.88 | IC18.2 25.8,69 25.8,70.83 26.92,71.95 26.92,74.99 IC18.12 26.92,75.09 26.92,75.5 23.26,79.16 23.26,85.86 24.99,87.59 v24.99,87.79 24.99,92.47 25.29,92.77 26.11,92.77 26.92,91.96 26.92,91.66 IC17.12
  VCC 0.102: v24.99,87.79 v25.9,86.88
CONT_MODE  (via drill 0.2)
  Top 0.102: v26.61,46.85 11.38,46.85 IC43.2 | v96.01,58.33 103.63,58.33 107.69,62.39 107.69,62.6 IC32.2 | v121.71,86.58 121.71,92.06 120.49,93.28 119.88,93.28 IC29.2
  Route14 0.102: v26.61,46.85 31.29,46.85 43.99,34.15 67.76,34.15 86.15,52.54 86.56,52.54 v87.07,53.05
  Bottom 0.102: v87.07,53.05 87.98,53.96 92.15,53.96 93.77,55.59 93.77,56.1 v96.01,58.33 96.01,59.35 121.71,85.05 v121.71,86.58
D1  (via drill 0.2)
  Top 0.102: v85.44,93.08 85.64,93.28 87.27,93.28 IC14.2 | v39.32,25.82 39.32,21.75 IC11.3
  Route15 0.102: v85.44,93.08 45.72,53.35 45.72,51.02 39.82,45.12 39.82,26.33 v39.32,25.82
D2  (via drill 0.2)
  Top 0.102: v85.44,92.37 85.75,92.67 87.27,92.67 IC14.3 | v41.86,26.02 41.86,21.75 IC11.5
  Route15 0.102: v85.44,92.37 85.44,90.44 41.86,46.85 v41.86,26.02
D3  (via drill 0.2)
  Top 0.102: v88.49,91.66 88.39,91.55 87.37,91.55 IC14.5 | v42.36,25.51 42.36,24.09 44.4,22.06 44.4,21.75 IC11.7
  Route3 0.102: v88.49,91.66 86.66,91.66 82.6,87.59 82.29,87.59 63.8,69.1 63.8,64.73 39.32,40.25 39.32,36.18 38.81,35.67 38.81,29.78 42.36,26.23 v42.36,25.51
D4  (via drill 0.2)
  Top 0.102: v78.63,67.88 78.63,89.93 79.85,91.15 83.1,91.15 83.41,90.84 87.27,90.84 IC14.6 | v75.38,50.51 47.04,22.16 47.04,21.75 IC11.9
  Route3 0.102: v78.63,67.88 78.63,53.76 v75.38,50.51
D5  (via drill 0.2)
  Top 0.102: v89.51,87.9 87.88,89.52 87.37,89.52 IC14.8 | v49.78,33.64 48.46,33.64 47.04,32.22 47.04,31.81 IC11.12
  Route3 0.102: v89.51,87.9 89.51,87.69 90.52,86.68 90.52,58.94 65.22,33.64 v49.78,33.64
D6  (via drill 0.2)
  Top 0.102: v85.64,87.69 85.64,88.51 86.05,88.91 87.27,88.91 IC14.9 | v80.26,52.84 71.22,52.84 53.64,35.27 46.12,35.27 45.82,35.57 45.41,35.57 44.9,35.06 44.9,32.22 44.5,31.81 IC11.14
  Route3 0.102: v85.64,87.69 85.64,65.65 83.61,63.61 83.61,56.2 v80.26,52.84
D7  (via drill 0.2)
  Top 0.102: v88.49,87.9 88.29,87.69 87.37,87.69 IC14.11 | v44.4,34.66 41.96,32.22 41.96,31.81 IC11.16
  Route14 0.102: v88.49,87.9 87.68,87.9 52.52,52.74 50.39,52.74 44.4,46.75 v44.4,34.66
D8  (via drill 0.2)
  Top 0.102: v84.43,86.58 86.25,86.58 86.66,86.98 87.27,86.98 IC14.12 | v39.32,34.76 39.32,31.81 IC11.18
  Route3 0.102: v84.43,86.58 76.4,78.55 76.4,72.96 39.32,35.88 v39.32,34.76
D9  (via drill 0.2)
  Top 0.102: v88.9,86.58 88.79,86.47 87.37,86.47 IC14.13 | v80.26,51.32 80.26,47.97 41.04,8.75 40.23,8.75 39.42,7.94 39.42,7.53 IC12.3
  Route3 0.102: v88.9,86.58 88.9,81.39 87.98,80.48 87.98,64.02 89.91,62.09 89.91,60.97 v80.26,51.32
D10  (via drill 0.2)
  Top 0.102: v83.71,84.65 84.73,85.66 87.27,85.66 IC14.14 | v80.77,55.49 80.77,46.75 41.96,7.94 41.96,7.53 IC12.5
  Route3 0.102: v83.71,84.65 83.71,84.24 80.77,81.29 v80.77,55.49
D11  (via drill 0.2)
  Top 0.102: v84.93,84.44 87.27,84.44 IC14.16 | v81.48,55.49 81.48,44.92 44.5,7.94 44.5,7.53 IC12.7
  Route3 0.102: v84.93,84.44 84.22,84.44 82.9,83.12 82.9,60.57 81.48,59.14 v81.48,55.49
D12  (via drill 0.2)
  Top 0.102: v84.43,83.93 87.27,83.93 IC14.17 | v82.19,55.49 82.19,43.09 47.04,7.94 47.04,7.53 IC12.9
  Route3 0.102: v84.43,83.93 84.43,80.38 83.41,79.36 83.41,56.71 v82.19,55.49
D13  (via drill 0.2)
  Top 0.102: v89,80.78 89,81.39 87.88,82.51 87.37,82.51 IC14.19 | v79.75,48.88 77.92,48.88 47.04,18 47.04,17.59 IC12.12
  Route3 0.102: v89,80.78 89,77.94 90.32,76.62 90.32,59.45 v79.75,48.88
D14  (via drill 0.2)
  Top 0.102: v84.93,83.43 86.36,82 87.27,82 IC14.20 | v76.2,52.34 76.2,47.66 47.34,18.81 45.31,18.81 44.5,18 44.5,17.59 IC12.14
  Bottom 0.102: v84.93,83.43 84.93,80.89 79.65,75.6 79.65,55.79 v76.2,52.34
D15  (via drill 0.2)
  Top 0.102: v86.15,80.58 87.27,80.58 IC14.22 | v41.25,16.17 41.25,16.88 41.86,17.49 IC12.16
  Route15 0.102: v86.15,80.58 86.15,80.07 71.32,65.24 71.32,64.53 47.04,40.25 46.73,40.25 42.97,36.49 42.97,17.89 v41.25,16.17
D16  (via drill 0.2)
  Top 0.102: v88.49,80.28 88.29,80.07 87.37,80.07 IC14.23 | v50.29,34.76 50.29,26.73 46.22,22.67 46.22,20.64 45.61,20.03 41.45,20.03 39.42,18 39.42,17.59 IC12.18
  Route15 0.102: v88.49,80.28 88.49,72.96 v50.29,34.76
DATA0  (via drill 0.2)
  Top 0.102: 98.04,94.2 97.73,94.5 85.95,94.5 84.83,93.38 80.67,93.38 IC22.47 | 98.04,94.2 98.04,93.79 97.63,93.38 97.13,93.38 IC14.47 | 128.22,93.99 128.83,93.38 129.54,93.38 IC29.47 | 128.22,93.99 127.71,94.5 118.46,94.5 117.34,93.38 113.69,93.38 IC7.47 113.58,93.38 113.08,93.38 111.86,94.6 v111.86,96.33 | 128.22,93.99 128.83,94.6 130.45,94.6 131.67,93.38 135.53,93.38 IC24.2 | 98.04,94.2 98.95,94.2 v100.99,96.23
  Bottom 0.102: v100.99,96.23 101.6,96.84 111.35,96.84 v111.86,96.33
DATA1  (via drill 0.2)
  Top 0.102: IC22.46 80.67,92.67 84.43,92.67 85.95,91.15 93.98,91.15 94.89,92.06 96.01,92.06 96.62,92.67 97.02,92.67 IC14.46 97.13,92.77 98.24,92.77 v100.99,95.52 | IC24.3 135.53,92.77 131.97,92.77 130.35,94.4 128.93,94.4 128.72,94.2 128.72,93.79 128.83,93.69 130.45,93.69 130.55,93.59 130.55,93.18 130.15,92.77 129.64,92.77 IC29.46 129.54,92.77 129.13,92.77 128.22,93.69 119.07,93.69 118.16,92.77 113.69,92.77 IC7.46 113.58,92.77 113.08,92.77 111.15,94.7 v111.15,96.33
  Bottom 0.102: v100.99,95.52 101.8,96.33 v111.15,96.33
DATA2  (via drill 0.2)
  Top 0.102: v117.14,71.74 117.55,72.15 117.55,72.35 IC37.1 | v112.47,91.35 113.48,91.35 113.58,91.45 IC7.44 | v110.13,93.69 106.68,97.14 82.6,97.14 78.02,92.57 78.02,90.74 78.33,90.44 78.74,90.44 79.75,91.45 80.56,91.45 IC22.44 | v102.71,92.87 101.39,92.87 100.07,91.55 97.13,91.55 IC14.44 | v114.8,93.89 115.72,94.81 135.94,94.81 136.55,94.2 136.55,91.86 136.24,91.55 135.63,91.55 IC24.5
  Route3 0.102: v117.14,71.74 117.14,73.57 111.96,78.75 111.96,90.84 v112.47,91.35
  Bottom 0.102: 112.37,91.45 v110.13,93.69 109.32,92.87 v102.71,92.87 | 112.37,91.45 v114.8,93.89 | 112.37,91.45 v112.47,91.35
DATA3  (via drill 0.2)
  Top 0.102: v132.18,90.84 129.64,90.84 IC29.43 | v133.19,90.84 135.53,90.84 IC24.6 135.63,90.84 136.14,90.84 136.75,91.45 136.75,94.3 134.21,96.84 110.94,96.84 110.64,96.53 110.64,90.84 | v84.63,90.33 83.61,90.33 83.21,90.74 80.67,90.74 IC22.43 | v89.4,90.23 96.01,90.23 96.52,90.74 97.02,90.74 IC14.43 97.13,90.84 97.23,90.94 100.07,90.94 100.27,91.15 104.64,91.15 104.95,90.84 110.64,90.84 | 110.64,90.84 113.58,90.84 IC7.43
  VCC 0.102: v133.19,90.84 v132.18,90.84 | v84.63,90.33 84.64,90.33 85.35,91.04 88.59,91.04 v89.4,90.23
DATA4  (via drill 0.2)
  Top 0.102: v132.18,89.52 129.64,89.52 IC29.41 | v133.19,89.52 135.53,89.52 IC24.8 | v85.64,89.63 v85.64,89.62 80.67,89.62 IC22.41 | v88.49,89.73 96.92,89.73 97.02,89.62 IC14.41 | v106.15,89.82 113.48,89.82 IC7.41
  VCC 0.102: v133.19,89.52 v132.18,89.52 | v85.64,89.63 85.74,89.73 v88.49,89.73
  Bottom 0.102: v106.15,89.82 105.03,90.94 100.48,90.94 | 100.48,90.94 90.83,90.94 89.61,89.73 v88.49,89.73 | v132.18,89.52 132.18,90.03 125.17,97.04 101.09,97.04 100.48,96.43 100.48,90.94
DATA5  (via drill 0.2)
  Top 0.102: v132.18,88.81 132.08,88.91 129.64,88.91 IC29.40 | v133.19,88.81 135.43,88.81 135.53,88.91 IC24.9 | v84.94,89.12 84.84,89.01 80.67,89.01 IC22.40 | v89,89.12 96.92,89.12 97.02,89.01 IC14.40 | IC7.40 113.33,89.21 v105.65,89.21
  VCC 0.102: v133.19,88.81 v132.18,88.81 | v89,89.12 v84.94,89.12
  Bottom 0.102: v89,89.12 89.2,88.91 98.45,88.91 98.95,89.42 105.44,89.42 v105.65,89.21 106.05,88.81 v132.18,88.81
DATA6  (via drill 0.2)
  Top 0.102: v132.18,87.79 132.08,87.69 129.64,87.69 IC29.38 | v133.19,87.9 134.21,87.9 134.41,87.69 135.53,87.69 IC24.11 | v86.15,87.19 85.44,87.19 85.03,87.59 80.67,87.59 IC22.38 | v88.49,87.19 96.21,87.19 96.62,87.59 97.02,87.59 IC14.38 | v105.05,88.1 105.46,87.69 113.58,87.69 IC7.38
  VCC 0.102: v132.18,87.79 133.09,87.79 v133.19,87.9 | v88.49,87.19 v86.15,87.19
  Bottom 0.102: v88.49,87.19 89.4,87.19 89.61,87.39 99.56,87.39 99.97,87.79 104.75,87.79 v105.05,88.1 105.35,87.79 v132.18,87.79
DATA7  (via drill 0.2)
  Top 0.102: v132.18,87.08 129.64,87.08 IC29.37 | v133.19,87.19 135.43,87.19 135.53,87.08 IC24.12 | v82.6,86.88 82.49,86.98 80.67,86.98 IC22.37 | v89.91,86.58 96.21,86.58 96.62,86.98 97.02,86.98 IC14.37 | v105.05,87.08 113.58,87.08 IC7.37
  VCC 0.102: v132.18,87.08 133.09,87.08 v133.19,87.19 | v82.6,86.88 83.41,86.07 89.4,86.07 v89.91,86.58
  Bottom 0.102: v89.91,86.58 90.11,86.37 104.34,86.37 v105.05,87.08 105.45,87.48 131.78,87.48 v132.18,87.08
DATA8  (via drill 0.2)
  Top 0.102: IC22.36 80.67,86.37 83.1,86.37 83.41,86.07 95.4,86.07 95.7,86.37 97.02,86.37 IC14.36 97.13,86.47 97.94,86.47 v99.36,87.9 | v124.25,86.07 119.07,86.07 118.77,86.37 113.69,86.37 IC7.36 | v125.27,86.07 129.23,86.07 129.54,86.37 IC29.36 | v133.19,86.47 135.53,86.47 IC24.13
  VCC 0.102: v125.27,86.07 v124.25,86.07
  Route15 0.102: v99.36,87.9 102.41,87.9 102.71,87.59 122.73,87.59 v124.25,86.07
  Bottom 0.102: v133.19,86.47 132.99,86.27 125.47,86.27 v125.27,86.07
DATA9  (via drill 0.2)
  Top 0.102: v132.18,85.76 129.64,85.76 IC29.35 | v133.19,85.76 135.53,85.76 IC24.14 | IC22.35 80.67,85.66 81.99,85.66 85.64,82 85.64,79.26 85.95,78.96 88.9,78.96 95.6,85.66 97.02,85.66 IC14.35 97.13,85.66 98.45,85.66 99.06,85.05 99.06,82.31 102.41,78.96 104.64,78.96 111.35,85.66 113.58,85.66 IC7.35 113.69,85.76 113.79,85.86 v114.8,85.86
  VCC 0.102: v133.19,85.76 v132.18,85.76
  Route3 0.102: v132.18,85.76 131.57,85.76 131.47,85.86 125.78,85.86 125.47,85.56 118.97,85.56 118.66,85.86 v114.8,85.86
DATA10  (via drill 0.2)
  Top 0.102: v132.18,84.54 129.64,84.54 IC29.33 | v133.19,84.54 135.53,84.54 IC24.16 | 98.85,79.97 97.94,79.06 95.6,79.06 93.87,80.78 92.96,80.78 90.93,78.75 85.85,78.75 85.44,79.16 85.44,80.58 81.58,84.44 80.67,84.44 IC22.33 | 98.85,79.97 98.85,83.32 97.73,84.44 97.13,84.44 IC14.33 | 98.85,79.97 100.07,78.75 104.75,78.75 110.43,84.44 v112.47,84.44 113.58,84.44 IC7.33
  VCC 0.102: v133.19,84.54 v132.18,84.54
  Route3 0.102: v132.18,84.54 131.77,84.54 131.47,84.24 115.21,84.24 115.01,84.44 v112.47,84.44
DATA11  (via drill 0.2)
  Top 0.102: v132.18,83.83 129.64,83.83 IC29.32 | v133.19,83.83 135.53,83.83 IC24.17 | 93.57,79.16 95.19,79.16 95.8,78.55 107.49,78.55 112.77,83.83 113.58,83.83 IC7.32 113.69,83.93 v114.8,83.93 | 93.57,79.16 91.64,79.16 91.03,78.55 85.75,78.55 85.24,79.06 85.24,80.48 81.89,83.83 80.67,83.83 IC22.32 | v94.48,81.19 94.48,82.61 95.7,83.83 97.02,83.83 IC14.32 | 93.57,79.16 v93.57,80.28
  VCC 0.102: v133.19,83.83 v132.18,83.83 | v93.57,80.28 v94.48,81.19
  Route3 0.102: v132.18,83.83 114.91,83.83 v114.8,83.93
DATA12  (via drill 0.2)
  Top 0.102: v132.18,82.61 129.64,82.61 IC29.30 | v133.19,82.61 135.53,82.61 IC24.19 | 84.43,79.67 85.03,79.06 85.03,78.96 85.64,78.35 91.13,78.35 91.74,78.96 95.09,78.96 95.7,78.35 107.59,78.35 111.76,82.51 112.47,82.51 | 84.43,79.67 81.58,82.51 80.67,82.51 IC22.30 | 112.47,82.51 113.58,82.51 IC7.30 | v94.99,82.41 95.09,82.51 97.02,82.51 IC14.30 | 84.43,79.67 v84.73,79.97 | 112.47,82.51 v112.47,82.61
  VCC 0.102: v133.19,82.61 v132.18,82.61
  Route3 0.102: v132.18,82.61 131.77,82.61 131.47,82.31 128.11,82.31 127,83.43 119.68,83.43 118.87,82.61 v112.47,82.61
  Bottom 0.102: v94.99,82.41 93.87,81.29 87.57,81.29 86.25,79.97 v84.73,79.97
DATA13  (via drill 0.2)
  Top 0.102: v132.18,81.9 129.64,81.9 IC29.29 | v133.19,81.9 135.53,81.9 IC24.20 | 95.5,76.62 109.32,76.62 112.26,79.57 112.26,81.09 113.08,81.9 113.58,81.9 IC7.29 113.69,82 113.79,82.11 v115.82,82.11 | 95.5,76.62 87.07,76.62 84.83,78.85 84.83,78.96 81.89,81.9 80.67,81.9 IC22.29 | v94.99,80.68 94.99,80.78 96.11,81.9 97.02,81.9 IC14.29 | 95.5,76.62 v95.5,77.84
  VCC 0.102: v133.19,81.9 v132.18,81.9 | v94.99,80.68 94.99,78.35 v95.5,77.84
  Route3 0.102: v132.18,81.9 128.22,81.9 127.61,82.51 124.15,82.51 123.74,82.11 v115.82,82.11
DATA14  (via drill 0.2)
  Top 0.102: v132.18,80.68 129.64,80.68 IC29.27 | v133.19,80.68 135.53,80.68 IC24.22 | 84.22,79.16 86.97,76.42 109.42,76.42 112.47,79.46 112.47,79.97 113.08,80.58 113.58,80.58 IC7.27 113.69,80.68 118.77,80.68 119.07,80.99 120.7,80.99 122.63,82.92 v123.85,82.92 | 84.22,79.16 82.8,80.58 80.67,80.58 IC22.27 | v95.91,80.99 96.21,80.68 97.02,80.68 IC14.27 | 84.22,79.16 v84.22,78.85
  VCC 0.102: v133.19,80.68 v132.18,80.68 132.18,80.99 130.25,82.92 v123.85,82.92
  Bottom 0.102: v95.91,80.99 95.5,80.58 95.5,80.48 94.18,79.16 86.66,79.16 86.36,78.85 v84.22,78.85
DATA15  (via drill 0.2)
  Top 0.102: IC22.26 80.67,79.97 82.39,79.97 v85.14,77.23 88.29,74.08 108.91,74.08 112.67,77.84 112.67,79.57 113.08,79.97 113.58,79.97 IC7.26 113.69,79.97 114.19,79.97 118.46,75.7 118.46,73.77 118.66,73.57 119.17,73.57 121.31,75.7 | v95.7,79.97 97.02,79.97 IC14.26 | 121.31,75.7 125.57,79.97 129.54,79.97 IC29.26 | 121.31,75.7 122.53,74.49 122.53,74.18 123.13,73.57 126.08,73.57 132.48,79.97 135.53,79.97 IC24.23
  Bottom 0.102: v95.7,79.97 92.96,77.23 v85.14,77.23
ENABLE  (via drill 0.2)
  Top 0.15: IC25.23 129.78,25.53 v129.5,25.81 | v91.2,48.81 90.5,48.81 IC46.1
  Route14 0.15: v129.5,25.81 126.47,25.81 126.19,26.09 113.92,26.09 v91.2,48.81
GND  (via drill 0.2)
  Top 0.102: IC44.3 101.7,67.58 101.7,66.97 v101.7,66.91 101.7,66.87 | 99.36,64.53 98.14,64.53 U$1.1 98.14,64.43 98.14,63.92 U$1.2 | C3.2 108.81,75.6 108.81,74.69 v108.8,74.61 | C9.2 135.53,20.84 135.53,19.93 v135.5,19.91 | IC25.28 140.61,26.73 140.1,26.73 139.7,26.33 139.7,25.31 140.1,24.9 140.51,24.9 IC25.25 | IC7.21 103.83,81.29 103.32,81.29 102.92,80.89 102.92,79.46 v102.7,79.41
  Top 0.152: IC35.3 96.9,54.41
  Top 0.305: C5.2 v75.5,74.61 | C4.2 92.3,75.66 v92.3,74.61 | IC22.21 69.7,81.3 v69.7,81.31 | IC22.24 69.7,79.39 v69.7,79.41 | IC22.15 v69.7,85.11 | IC22.10 69.7,88.28 v69.7,88.31 | IC22.4 69.7,92.09 v69.7,92.11 | IC22.1 69.7,94 v69.7,94.01 | IC22.45 81.8,92.09 v81.8,92.11 | IC22.39 81.8,88.28 v81.8,88.31 | IC22.34 v81.8,85.11 | IC22.28 81.8,81.3 v81.8,81.31 | IC14.24 87.37,79.41 v86.2,79.41 | IC14.21 87.37,81.31 v86.2,81.31 | IC14.15 v86.2,85.11 | IC14.10 87.37,88.31 v86.2,88.31 | IC14.4 87.37,92.11 v86.2,92.11 | IC14.1 87.37,94.01 v86.2,94.01 | IC14.45 97.12,92.11 v98.3,92.11 | IC14.39 97.12,88.31 v98.3,88.31 | IC14.34 v98.3,85.11 | IC14.28 98.3,81.3 v98.3,81.31 | IC7.24 103.87,79.41 v102.7,79.41 | IC7.15 v102.7,85.11 | IC7.10 103.87,88.31 v102.7,88.31 | IC7.4 103.87,92.11 v102.7,92.11 | IC7.1 103.87,94.01 v102.7,94.01 | IC7.45 113.62,92.11 v114.8,92.11 | IC7.39 113.62,88.31 v114.8,88.31 | IC7.34 v114.8,85.11 | IC7.28 113.62,81.31 v114.8,81.31 | IC29.24 118.7,79.39 v118.7,79.41 | IC29.21 118.7,81.3 v118.7,81.31 | IC29.15 v118.7,85.11 | IC29.10 118.7,88.28 v118.7,88.31 | IC29.4 118.7,92.09 v118.7,92.11 | IC29.1 118.7,94 v118.7,94.01 | IC29.45 129.62,92.11 v130.8,92.11 | IC29.39 129.62,88.31 v130.8,88.31 | IC29.34 v130.8,85.11 | IC29.28 129.62,81.31 v130.8,81.31 | IC24.24 134.5,79.39 v134.5,79.41 | IC24.21 134.5,81.3 v134.5,81.31 | IC24.15 v134.5,85.11 | IC24.10 134.5,88.28 v134.5,88.31 | IC24.4 134.5,92.09 v134.5,92.11 | IC24.1 134.5,94 v134.5,94.01 | IC24.48 145.37,94.01 v146.5,94.01 | IC24.45 145.37,92.11 v146.5,92.11 | IC24.39 145.37,88.31 v146.5,88.31 | IC24.34 v146.5,85.11 | IC24.28 145.37,81.31 v146.5,81.31 | IC24.25 145.37,79.41 v146.5,79.41
  Top 0.305: C1.2 v140.5,74.61 | C2.2 127.6,76.76 v127.6,76.71 | C6.2 v126.7,72.51 | IC38.3 123.4,71.71 v123.5,71.71 | IC37.3 v119.5,72.41 | IC40.3 v119,68.91 | IC39.3 122.7,68.66 v122.7,68.51 | C12.2 v121.5,63.31 | C11.2 117.8,64.41 v117.8,63.31 | IC27.7 139.1,65.69 v139.1,64.31 | C7.2 126.7,61.26 v126.7,61.31 | IC26.7 139.1,55.19 v139.1,53.81 | C8.2 v126.9,51.01 | IC2.7 139.06,43.21 v139.1,43.21 | IC25.48 141.7,39.5 v141.7,39.51 | IC25.45 141.7,37.59 v141.7,37.61 | IC25.39 141.7,33.78 v141.7,33.81 | IC25.34 v141.7,30.61 | IC25.25 141.7,24.89 v141.7,24.91 | IC25.24 130.87,24.91 v129.8,24.91 | IC25.15 v129.8,30.61 | IC25.10 129.8,33.78 v129.8,33.81 | IC25.4 129.8,37.59 v129.8,37.61 | IC25.1 129.8,39.5 v129.8,39.51 | IC16.10 126.2,30.98 v126.2,29.61 | R22.1 125,25.41 v125.1,25.41 | R21.1 v122.5,25.41 | R20.1 v120,25.41 | R19.1 v117.5,25.41 | R23.1 v125,46.41 | R24.1 v122.5,46.41 | R25.1 v120,46.41 | R26.1 v117.5,46.41 | C10.2 v114,46.11 | IC32.3 108.7,62.66 v108.7,61.91 | v112.1,60.01 111.6,60.01 C29.2 111.4,59.21 v112.1,59.21 | U$1.4 98.1,62.51 v97.3,62.51 | IC33.3 107.9,54.16 v107.9,53.61 | IC8.3 102.1,54.21 v102.1,53.61 | 96.9,54.41 97.1,54.21 v97.1,53.61 | IC36.3 92.8,54.01 v92.8,53.41 | IC34.3 88.3,54.01 v88.3,53.41 | IC28.3 87.5,62.31 v87.5,62.01 | IC30.3 91.2,62.36 v91.2,62.01 | IC31.3 95.2,62.36 v95.2,62.01 | v82.9,59.91 83.5,59.91 C28.2 83.6,59.21 v82.9,59.21 | C22.2 v33.6,95.01 | C20.2 20.85,91.71 v19.9,91.71 | IC17.7 32.06,84.07 v32,84.01 | IC19.1 36.78,80.83 v36.8,80.81 | IC19.10 48.21,82.2 v48.9,81.51 | IC21.3 25.65,78.76 v25.7,78.71 | IC23.3 30.65,78.96 v30.9,78.71 | C27.2 33.6,79.21 v32.7,79.21 | C19.2 20.85,75.21 v19.9,75.21 | IC18.7 32.06,67.55 v32.1,67.51
  Top 0.305: IC20.1 36.78,67.33 v36.8,67.31 | IC20.10 48.21,67.33 v48.2,67.31 | C18.2 29.1,61.71 v28.1,61.71 | C21.2 v20.5,59.91 | C26.2 40.35,63.81 v39.4,63.81 | IC42.3 11.9,68.31 v12.6,68.31 | IC41.3 v12.3,87.61 | IC43.3 11.35,47.51 v12.1,47.51 | Q1.2 19.02,52.44 v19,52.41 | U$2.4 22.67,47.81 v21.5,47.81 | IC1.7 v38.81,52.02 v38.8,52.01 | IC4.1 42.53,49.85 v42.5,49.81 | IC6.3 35.9,50.21 v36.6,50.21 | C24.2 v38.1,49.01 | C17.2 v26.4,45.01 | IC3.7 38.8,39.68 v38.8,38.31 | IC5.1 42.53,36.35 v42.5,36.31 | C23.2 v33.9,34.51 | C16.2 21.55,31.91 v20.6,31.91 | IC9.7 32.5,25.63 v32.5,24.26 | IC11.1 36.78,20.43 v36.8,20.41 | IC15.3 31.55,19.01 v32,19.01 | IC13.3 26.9,18.91 v27.2,18.91 | v32.4,17.71 33.35,17.71 C25.2 | IC11.10 48.21,20.33 v48.2,20.31 | C15.2 v19.9,13.51 | IC10.7 32.1,7.4 v32.1,6.01 | IC12.1 36.8,7.47 v36.8,6.11 | IC12.10 48.3,7.4 v48.3,6.11 | IC5.10 54,37.7 v54,36.31 | IC4.10 54.68,50.51 v54.7,50.51 | IC16.1 114.8,30.97 v114.8,29.61 | C13.2 126.75,18.86 v126.8,18.91 | C13.2 127.5,18.16 v127.5,18.91 | C13.2 126.1,18.06 v126.1,18.91 | 129.72,12.09 C14.2 130.35,11.31 v131.1,11.31 | 129.72,12.09 130.35,12.71 v131.1,12.71 | v131.1,12.01 129.8,12.01 129.72,12.09 | v125.9,10.31 124.96,10.31 U$9.1 | v125.9,9.51 124.53,9.51 U$9.1 | v125.9,8.71 124.91,9.7 U$9.1 | v124.9,8.71 124.34,9.26 U$9.1 | v123.8,8.71 123.8,9.15 U$9.1 | IC45.3 30.75,37.16 v30.6,37.31
  other vias: 81.8,61.21 74.3,60.91 75.7,64.01 77.2,66.71 75.4,67.31 72.4,67.41 69,67.21 71.1,69.91 68.2,70.61 65.5,67.21 104.3,61.01 100.1,59.61 94.1,59.81 91.7,60.51 96.2,65.71 96,67.11 97.2,69.31 93.2,69.71 95.9,72.51 101.4,72.61 106.9,72.41 113.1,73.91 111.5,69.11 84.4,72.01 81.7,70.51 79.2,76.71 116.9,78.91 116.6,76.71 115.7,76.01 114.3,74.31 116.4,85.11 116.2,89.51 116.5,86.91 53.4,68.61 54.9,71.81 57.7,76.91 60,79.21 60.9,81.01 62.3,83.41 17.7,83.31 15.1,81.51 20.7,80.01 18.2,78.41 16.7,69.01 17.6,65.51 21.9,62.71 25.6,61.41 41.4,66.51 34.3,63.61 40.9,61.21 44.1,63.41 40.6,58.31 47,53.61 59.3,47.11 57.4,48.01 52.5,41.71 112.9,20.81 109.8,22.31 102.4,10.41 98.5,12.61 90.1,51.21 129.6,26.81 72,53.91 69.6,56.81 67.1,55.01 56.2,51.01 61.6,56.01 64.1,58.51 65.8,60.51 68.6,63.21 65.4,63.51 62.6,60.51 60.8,58.61 56.7,54.51 56.7,60.51 59.5,63.41 54.3,63.71 58.7,68.21 49.9,66.11 46.9,63.71 50,64.21 27.3,66.51 38.6,71.81 28.2,72.41 46.5,72.51 40.7,74.71 37.5,75.31 34.2,75.81 49.8,75.51 52.8,85.61 49.7,86.41 64.9,82.61 51.7,90.61 43.7,84.01 45.5,88.91 41.8,87.61 42.3,85.51 29.6,88.61 34.3,90.11 33.8,92.11 38.8,89.81 40,94.71 49.3,94.71 53.8,92.11 53.7,94.01 66.3,95.31 67.3,90.71 64.9,87.91 53.3,83.01 76,93.71 82.2,95.21 98.5,95.61 113,48.51 129.7,53.51 115.2,57.41 110.9,36.41 111.1,33.31 110.2,28.21 109.7,40.61 147.3,16.31 142.5,23.41 140.4,23.21 139.2,22.31 147.5,20.91 142.9,25.51 142.9,27.41 147.8,22.51 137.4,33.31 134.3,36.71 137.2,47.81 134,48.21 132.4,48.11 134.2,42.61 136.9,42.31 141.5,41.91 142.5,54.91 142.2,63.81 138.4,58.01 129.6,65.71 145.5,66.51 122.7,76.01 105.1,77.31 97.3,77.41 107.6,80.11 100.3,85.41 46.2,24.41 49.5,31.91 40.8,34.21 34.4,28.51 23.4,25.11 23.1,16.81 28.7,16.81 34.5,14.81 45.9,10.71 44.6,11.51 42.8,13.11 40.1,10.51 27.9,10.71 51.5,20.91 59.3,28.51 48.2,10.51 59.3,21.31 81.1,43.31 53.5,18.21 60.8,27.61 80.4,45.71 66.7,36.41 72.2,50.81 74.8,48.01 77.8,51.11 79.6,54.01 84.9,44.61 91.7,32.21 72.3,22.91 72.5,8.21 110.4,64.81 111.3,62.41 110.8,80.51 121.9,81.31 116.7,94.11 116.6,95.61 130.5,95.71 28.6,51.81 25.1,46.31 13.7,46.31 9.9,50.91 8.6,42.81 22.7,43.41 10.1,32.31 12.6,8.61 27.8,21.81 38.5,13.81 37.6,25.41 40.5,26.61 25.3,28.31 47.1,34.71 32.9,42.61 29.4,42.21 26.2,34.61 51.8,30.31 55.4,29.01 73.4,35.61 108,69.11 129.6,47.01 120.5,54.01 119.7,35.41 115.5,38.11 110.9,44.11 114,27.51 109,25.61 128.2,22.41 135.1,28.61 142.6,13.91 100.6,90.11 101.3,87.01 99.3,65.41
  pour Bottom: 1,10.01 8,10.01 8,4.01 154,4.01 154,9.01 159,9.01 159,91.01 154,91.01 154,96.01 8,96.01 8,90.01 1,90.01
  pour Top (rank 2): 8,96.01 8,90.01 1,90.01 1,10.01 8,10.01 8,4.01 154,4.01 154,9.01 159,9.01 159,91.01 154,91.01 154,96.01
  pour Route15: 8,96.01 8,90.01 1,90.01 1,10.01 8,10.01 8,4.01 154,4.01 154,9.01 159,9.01 159,91.01 154,91.01 154,96.01
IS_EQUAL_B  (via drill 0.2)
  Top 0.102: 31.8,38.52 31.8,39.03 32.41,39.64 IC3.2 32.51,39.74 32.51,40.04 33.93,41.47 v35.76,41.47 | 31.8,38.52 31.8,37.2 IC45.2 | IC1.12 33.63,59.55 33.63,59.14 32.51,58.03 32.51,53.45 IC1.2 32.41,53.35 32.41,52.74 31.7,52.03 31.7,44.72 30.68,43.7 30.68,38.62 30.78,38.52 31.8,38.52 | IC6.4 34.23,50.1 34.23,49.59 34.74,49.09 34.74,47.15 33.73,46.14 33.73,45.94 IC3.12 33.73,45.53 35.25,44.01 42.36,44.01 | 42.36,44.01 52.12,44.01 64.11,55.99 82.39,55.99 85.85,52.54 96.72,52.54 98.55,54.37 100.58,54.37 IC8.1 | 42.36,44.01 v42.36,42.58
  Bottom 0.102: v35.76,41.47 41.25,41.47 v42.36,42.58
IS_EQUAL_C  (via drill 0.2)
  Top 0.102: 29.97,79.57 30.07,79.46 IC23.2 29.97,79.57 | 29.97,79.57 29.56,79.97 29.46,79.97 28.34,81.09 25.7,81.09 IC21.4 | 120.49,65.95 120.49,69.2 121.71,70.42 121.71,72.86 121.81,72.96 125.57,72.96 128.11,70.42 134.21,70.42 135.23,71.44 135.23,71.74 IC27.11 | 120.49,65.95 120.49,65.34 108.3,53.15 107.49,53.15 106.57,54.06 106.57,54.17 106.37,54.37 IC33.1 | 29.97,79.57 30.88,80.48 36.47,80.48 36.67,80.28 45.21,80.28 45.92,80.99 50.09,80.99 55.06,85.97 v66.24,85.97 | 120.49,65.95 v119.17,65.95
  Route15 0.102: v66.24,85.97 76.7,85.97 84.32,93.59 85.85,93.59 88.49,90.94 89.4,90.94 95.3,85.05 95.3,84.95 96.41,83.83 101.29,83.83 104.54,80.58 104.54,79.87 115.01,69.41 115.72,69.41 v119.17,65.95
IS_EQUAL_D  (via drill 0.2)
  Top 0.102: IC13.4 26.72,20.84 29.26,20.84 30.17,19.93 35.05,19.93 35.96,19.01 v37.89,19.01 38.2,19.01 38.6,18.61 38.6,16.47 38.5,16.37 33.02,16.37 30.78,18.61 30.78,19.11 IC15.2 | v127.4,67.27 128.42,68.29 134.62,68.29 137.77,71.44 137.77,71.74 IC27.9
  Route3 0.102: v127.4,67.27 102.81,67.27 54.55,19.01 v37.89,19.01
IS_SEL  (via drill 0.2)
  Top 0.102: IC41.2 11.58,86.88 11.78,86.88 21.84,76.82 21.84,69.91 26.31,65.44 83.92,65.44 86.46,62.9 86.46,62.7 IC28.2 86.56,62.6 86.56,62.29 87.37,61.48 v88.39,61.48 | v128.11,67.27 136.55,67.27 137.77,66.05 137.77,65.75 IC27.6
  Route14 0.102: v128.11,67.27 127.3,66.46 101.9,66.46 98.45,63 89.91,63 v88.39,61.48
MOD_CLK_TIMING  (via drill 0.2)
  Top 0.102: v135.33,38.42 126.39,47.36 112.26,47.36 103.53,56.1 101.9,56.1 IC8.4
  Bottom 0.102: v135.33,38.42 149.15,24.6 150.67,24.6 154.43,20.84 154.63,20.84 J1.A28
MOD_RES_SEL  (via drill 0.2)
  Top 0.102: v117.75,71.34 117.75,70.42 114.6,67.27 114.6,64.12 114.19,63.72 113.99,63.72 110.33,60.06 110.33,58.03 107.08,54.77 107.08,54.47 IC33.2 | v117.65,89.32 117.65,91.76 118.56,92.67 119.78,92.67 IC29.3
  Route14 0.102: v117.75,71.34 117.75,89.22 v117.65,89.32
MOD_RESET  (via drill 0.2)
  Top 0.102: v135.33,39.23 127,47.56 112.37,47.56 105.96,53.96 105.96,54.88 107.18,56.1 107.59,56.1 IC33.4
  Bottom 0.102: v135.33,39.23 137.05,39.23 149.15,27.14 150.67,27.14 154.43,23.38 154.63,23.38 J1.A27
N$1  (via drill 0.2)
  Top 0.102: v35.76,56.91 34.44,58.23 34.44,60.46 34.13,60.77 33.32,60.77 32.51,59.96 32.51,59.65 IC1.13 | v36.78,55.89 36.78,54.17 37.49,53.45 IC1.6 | v44.4,55.89 47.14,55.89 51.41,51.63 51.41,51.32 IC4.8
  VCC 0.102: v36.78,55.89 v35.76,56.91
  Bottom 0.102: v36.78,55.89 v44.4,55.89
N$2
  Top 0.102: IC3.1 31.19,39.74 31.19,43.9 31.9,44.61 31.9,51.22 33.22,52.54 33.22,54.57 35.05,56.4 35.96,56.4 38.71,59.14 38.71,59.55 IC1.8 38.81,59.65 42.47,59.65 43.07,60.26 43.07,62.19 43.38,62.5 45.51,62.5 46.33,61.68 46.33,61.38 IC4.17
N$3
  Top 0.102: 44.29,41.16 48.36,41.16 51.41,38.11 51.41,37.81 IC5.8 | 44.29,41.16 36.78,41.16 32.51,45.43 32.51,45.83 IC3.13 | 44.29,41.16 44.29,36.59 43.48,35.78 40.64,35.78 37.59,38.82 37.59,39.64 IC3.6
N$4
  Top 0.102: 96.92,56.1 99.77,56.1 101.19,54.67 101.19,54.47 IC8.2
  Top 0.152: IC35.4 96.92,56.1
N$5
  Top 0.102: IC4.2 43.79,51.22 43.79,50.41 42.67,49.29 42.16,49.29 40.13,51.32 35.45,51.32 33.73,53.05 33.73,53.35 IC1.3
N$6
  Top 0.102: IC4.4 46.33,51.32 46.33,52.64 42.57,56.4 36.57,56.4 35.05,54.88 35.05,53.45 IC1.4
N$7
  Top 0.102: IC1.5 36.27,53.35 36.27,53.05 37.79,51.52 41.25,51.52 42.16,52.44 44.19,52.44 44.5,52.13 44.5,50.2 44.7,50 46.73,50 47.04,50.3 47.04,52.23 47.24,52.44 48.05,52.44 48.87,51.63 48.87,51.32 IC4.6
N$8
  Top 0.102: IC1.11 35.05,59.65 35.05,60.46 39.42,64.83 51.1,64.83 53.95,61.99 53.95,61.38 IC4.11
N$9  (via drill 0.2)
  Top 0.102: v48.76,63.51 47.65,64.63 39.52,64.63 36.27,61.38 36.27,59.65 IC1.10 | v49.48,62.8 49.48,60.36 49.78,60.06 50.49,60.06 51.41,60.97 51.41,61.28 IC4.13
  VCC 0.102: v49.48,62.8 v48.76,63.51
N$10
  Top 0.102: IC1.9 37.59,59.65 37.59,59.96 40.74,63.11 41.04,63.11 41.35,63.41 41.35,64.33 41.45,64.43 44.8,64.43 47.04,62.19 47.04,60.26 47.24,60.06 47.95,60.06 48.87,60.97 48.87,61.28 IC4.15
N$11
  Top 0.102: IC5.2 43.79,37.81 43.79,38.11 40.94,40.96 34.64,40.96 33.73,40.04 33.73,39.74 IC3.3
N$12
  Top 0.102: IC5.4 46.33,37.71 46.33,37.4 44.29,35.37 39.72,35.37 36.57,38.52 35.86,38.52 35.05,39.33 35.05,39.64 IC3.4
N$13
  Top 0.102: IC5.6 48.87,37.81 48.87,38.52 47.14,40.25 46.02,40.25 44.5,38.72 44.5,36.49 43.58,35.57 40.03,35.57 36.27,39.33 36.27,39.64 IC3.5
N$14
  Top 0.102: 28.24,27.34 28.24,24.6 28.34,24.5 30.48,24.5 31.19,25.21 31.19,25.62 IC9.6 | 28.24,27.34 28.24,32.73 27.94,33.03 27.02,33.03 26.21,32.22 26.21,31.91 IC9.13 | 28.24,27.34 41.25,27.34 45.61,22.97 45.61,21.75 IC11.8
N$15
  Top 0.102: IC3.11 35.05,45.94 35.05,46.24 35.86,47.05 37.89,47.05 38.3,46.65 38.3,44.72 38.4,44.61 45.41,44.61 47.04,46.24 47.04,48.78 47.44,49.19 51,49.19 52.12,50.3 52.12,52.23 52.52,52.64 54.86,52.64 55.27,52.23 55.27,49.09 54.05,47.87 IC5.11
N$16
  Top 0.102: IC3.10 36.27,45.53 37.59,44.21 48.15,44.21 51.41,47.46 51.41,47.76 IC5.13
N$17
  Top 0.102: IC3.9 37.59,45.83 37.59,45.12 38.3,44.41 46.83,44.41 48.87,46.44 48.87,47.76 IC5.15
N$18
  Top 0.102: IC3.8 45.31,45.83 45.61,45.53 46.02,45.53 46.33,45.83 46.33,47.76 IC5.17
N$19
  Top 0.102: IC6.1 35.86,48.78 37.59,48.78 39.82,46.55 44.19,46.55 44.5,46.85 44.5,48.78 45.11,49.39 48.66,49.39 49.37,50.1 49.37,52.34 46.33,55.38 44.19,55.38 43.89,55.69 43.89,61.28 IC4.19
N$20
  Top 0.102: IC6.2 35.86,49.59 38.4,49.59 38.5,49.69 41.45,49.69 42.16,48.98 42.97,48.98 43.79,48.17 43.79,47.87 IC5.19
N$21  (via drill 0.2)
  Top 0.102: v22.14,20.74 21.84,20.43 21.84,12.92 24.38,10.38 24.38,7.53 IC10.1 | v31.8,30.39 31.8,31.1 32.51,31.81 IC9.8 32.61,31.81 34.23,30.19 39.62,30.19 40.53,31.1 40.53,31.71 IC11.17
  VCC 0.102: v31.8,30.39 v22.14,20.74
N$22
  Top 0.102: 27.53,6.41 27.73,6.62 27.73,8.55 28.04,8.85 30.07,8.85 30.78,8.14 30.78,7.53 IC10.6 | 27.53,6.41 27.33,6.21 26.61,6.21 26.41,6.41 26.41,10.07 25.8,10.68 25.8,13.53 IC10.13 | 27.53,6.41 28.85,5.09 43.58,5.09 45.61,7.12 45.61,7.43 IC12.8
N$23
  Top 0.102: IC11.2 37.99,21.75 37.99,22.16 36.37,23.79 28.75,23.79 27.53,25.01 27.53,25.62 IC9.3
N$24
  Top 0.102: IC11.4 40.53,21.75 40.53,25.31 38.71,27.14 29.87,27.14 28.75,26.02 28.75,25.72 IC9.4
N$25
  Top 0.102: IC11.6 43.07,21.65 43.07,21.35 42.26,20.54 38.91,20.54 38.6,20.84 38.6,22.77 34.44,26.94 30.88,26.94 30.07,26.12 30.07,25.72 IC9.5
N$26
  Top 0.102: IC11.11 48.15,31.71 48.15,31.41 46.43,29.68 30.58,29.68 28.75,31.51 28.75,31.81 IC9.11
N$27
  Top 0.102: IC11.13 45.61,31.71 45.61,31.41 44.09,29.88 31.59,29.88 30.07,31.41 30.07,31.81 IC9.10
N$28
  Top 0.102: IC11.15 43.07,31.71 43.07,31.41 42.26,30.59 41.45,30.59 41.14,30.9 41.14,32.83 40.94,33.03 40.23,33.03 39.82,32.63 39.82,30.7 39.52,30.39 35.66,30.39 33.02,33.03 32.1,33.03 31.29,32.22 31.29,31.91 IC9.9
N$29
  Top 0.102: IC10.3 27.02,7.53 27.02,8.14 27.94,9.05 36.78,9.05 37.99,7.84 37.99,7.53 IC12.2
N$30
  Top 0.102: IC10.4 28.34,7.53 28.34,7.84 29.15,8.65 29.97,8.65 30.27,8.34 30.27,6.31 31.09,5.5 38.91,5.5 40.53,7.12 40.53,7.43 IC12.4
N$31
  Top 0.102: IC10.5 29.56,7.43 29.56,6.72 30.98,5.3 41.25,5.3 43.07,7.12 43.07,7.43 IC12.6
N$32
  Top 0.102: IC10.11 28.34,13.53 28.34,13.12 29.46,12 42.97,12 48.15,17.18 48.15,17.49 IC12.11
N$33
  Top 0.102: IC10.10 29.56,13.53 29.56,13.22 30.58,12.2 40.64,12.2 45.61,17.18 45.61,17.49 IC12.13
N$34
  Top 0.102: IC10.9 30.88,13.53 30.88,13.12 31.59,12.41 38.3,12.41 43.07,17.18 43.07,17.49 IC12.15
N$35
  Top 0.102: IC10.8 32.1,13.63 36.98,13.63 40.53,17.18 40.53,17.49 IC12.17
N$36
  Top 0.102: IC13.1 25.29,19.21 25.29,20.13 24.38,21.04 24.38,29.68 25.7,31 25.7,32.93 26.01,33.24 33.73,33.24 36.37,30.59 37.18,30.59 37.99,31.41 37.99,31.71 IC11.19
N$37
  Top 0.102: IC13.2 26.01,19.21 26.21,19.42 26.21,19.52 26.41,19.72 34.95,19.72 35.86,18.81 37.08,18.81 37.99,17.89 37.99,17.59 IC12.19
N$38  (via drill 0.2)
  Top 0.102: v115.52,68.9 114.7,68.9 112.37,66.56 112.37,64.53 105.25,57.42 93.37,57.42 92.25,56.3 92.25,55.49 93.27,54.47 93.27,53.15 93.06,52.95 88.08,52.95 87.57,53.45 87.57,54.06 IC34.2 | v127.71,71.54 130.15,71.54 131.06,70.62 133.09,70.62 133.91,71.44 133.91,71.74 IC27.12
  VCC 0.102: v115.52,68.9 117.95,68.9 119.48,70.42 126.59,70.42 v127.71,71.54
N$39  (via drill 0.2)
  Top 0.102: v26.61,89.32 25.8,90.13 25.8,91.55 IC17.13 | v29.05,86.88 29.66,86.88 30.78,85.76 | 30.78,85.76 30.78,85.46 IC17.6 30.78,85.76 | 30.78,85.76 31.7,86.68 38.91,86.68 39.93,85.66 39.93,81.29 40.23,80.99 44.8,80.99 45.61,81.8 45.61,82.21 IC19.8
  VCC 0.102: v29.05,86.88 v26.61,89.32
N$40
  Top 0.102: S1.16 107.59,44.61 107.59,44.11 116.73,34.96 116.73,33.24 117.34,32.63 117.34,31 IC16.3
  Top 0.152: R19.2 117.5,30.81 IC16.3
N$41  (via drill 0.2)